# EAGLE board display72 (EAGLE 7.7.0), part 1 of 2
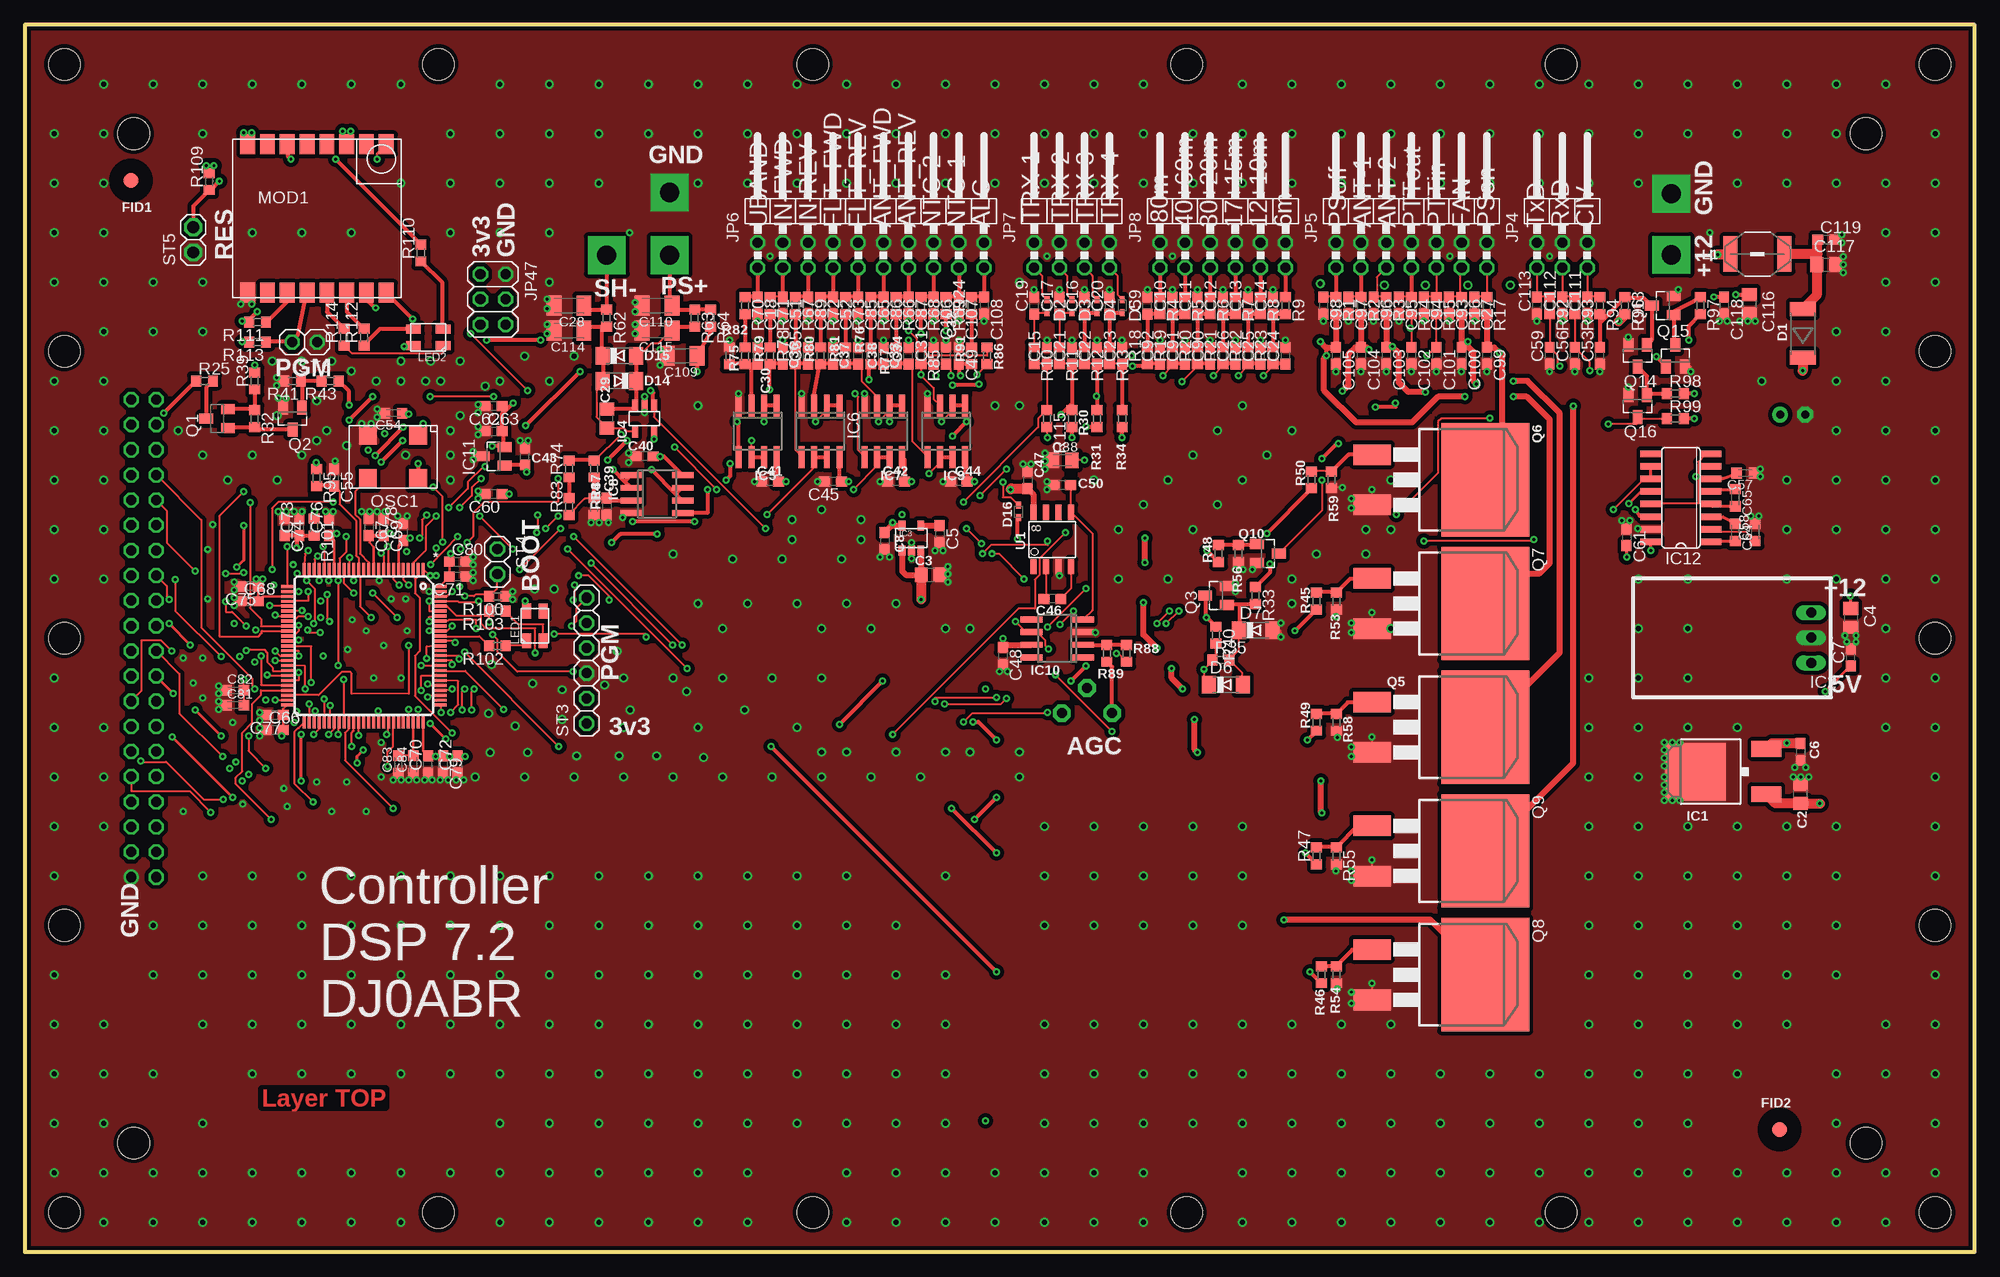
[diagram p5: board, top side]
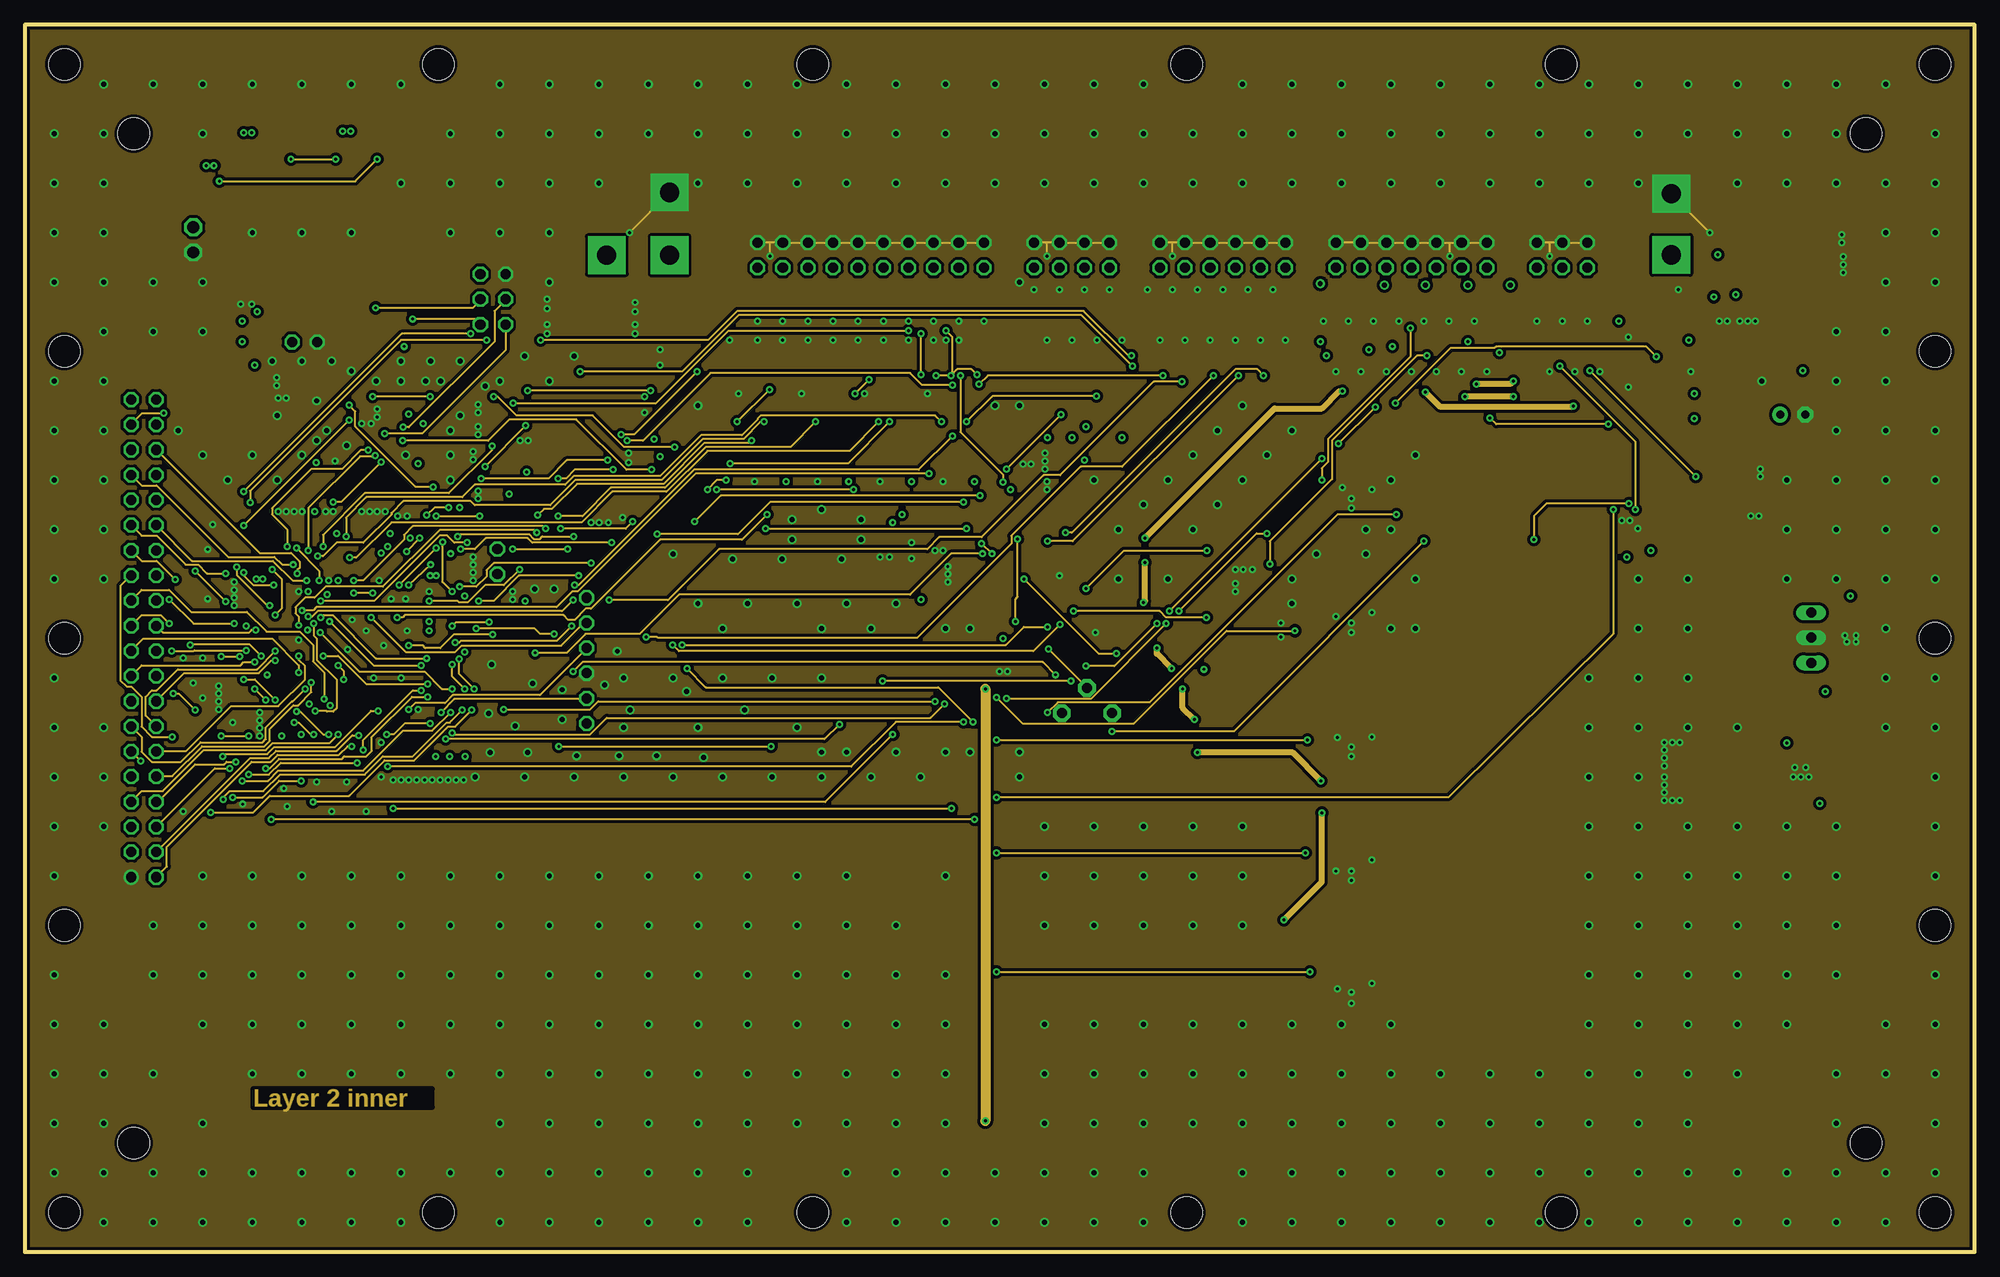
[diagram p6: board, inner layer Route2]
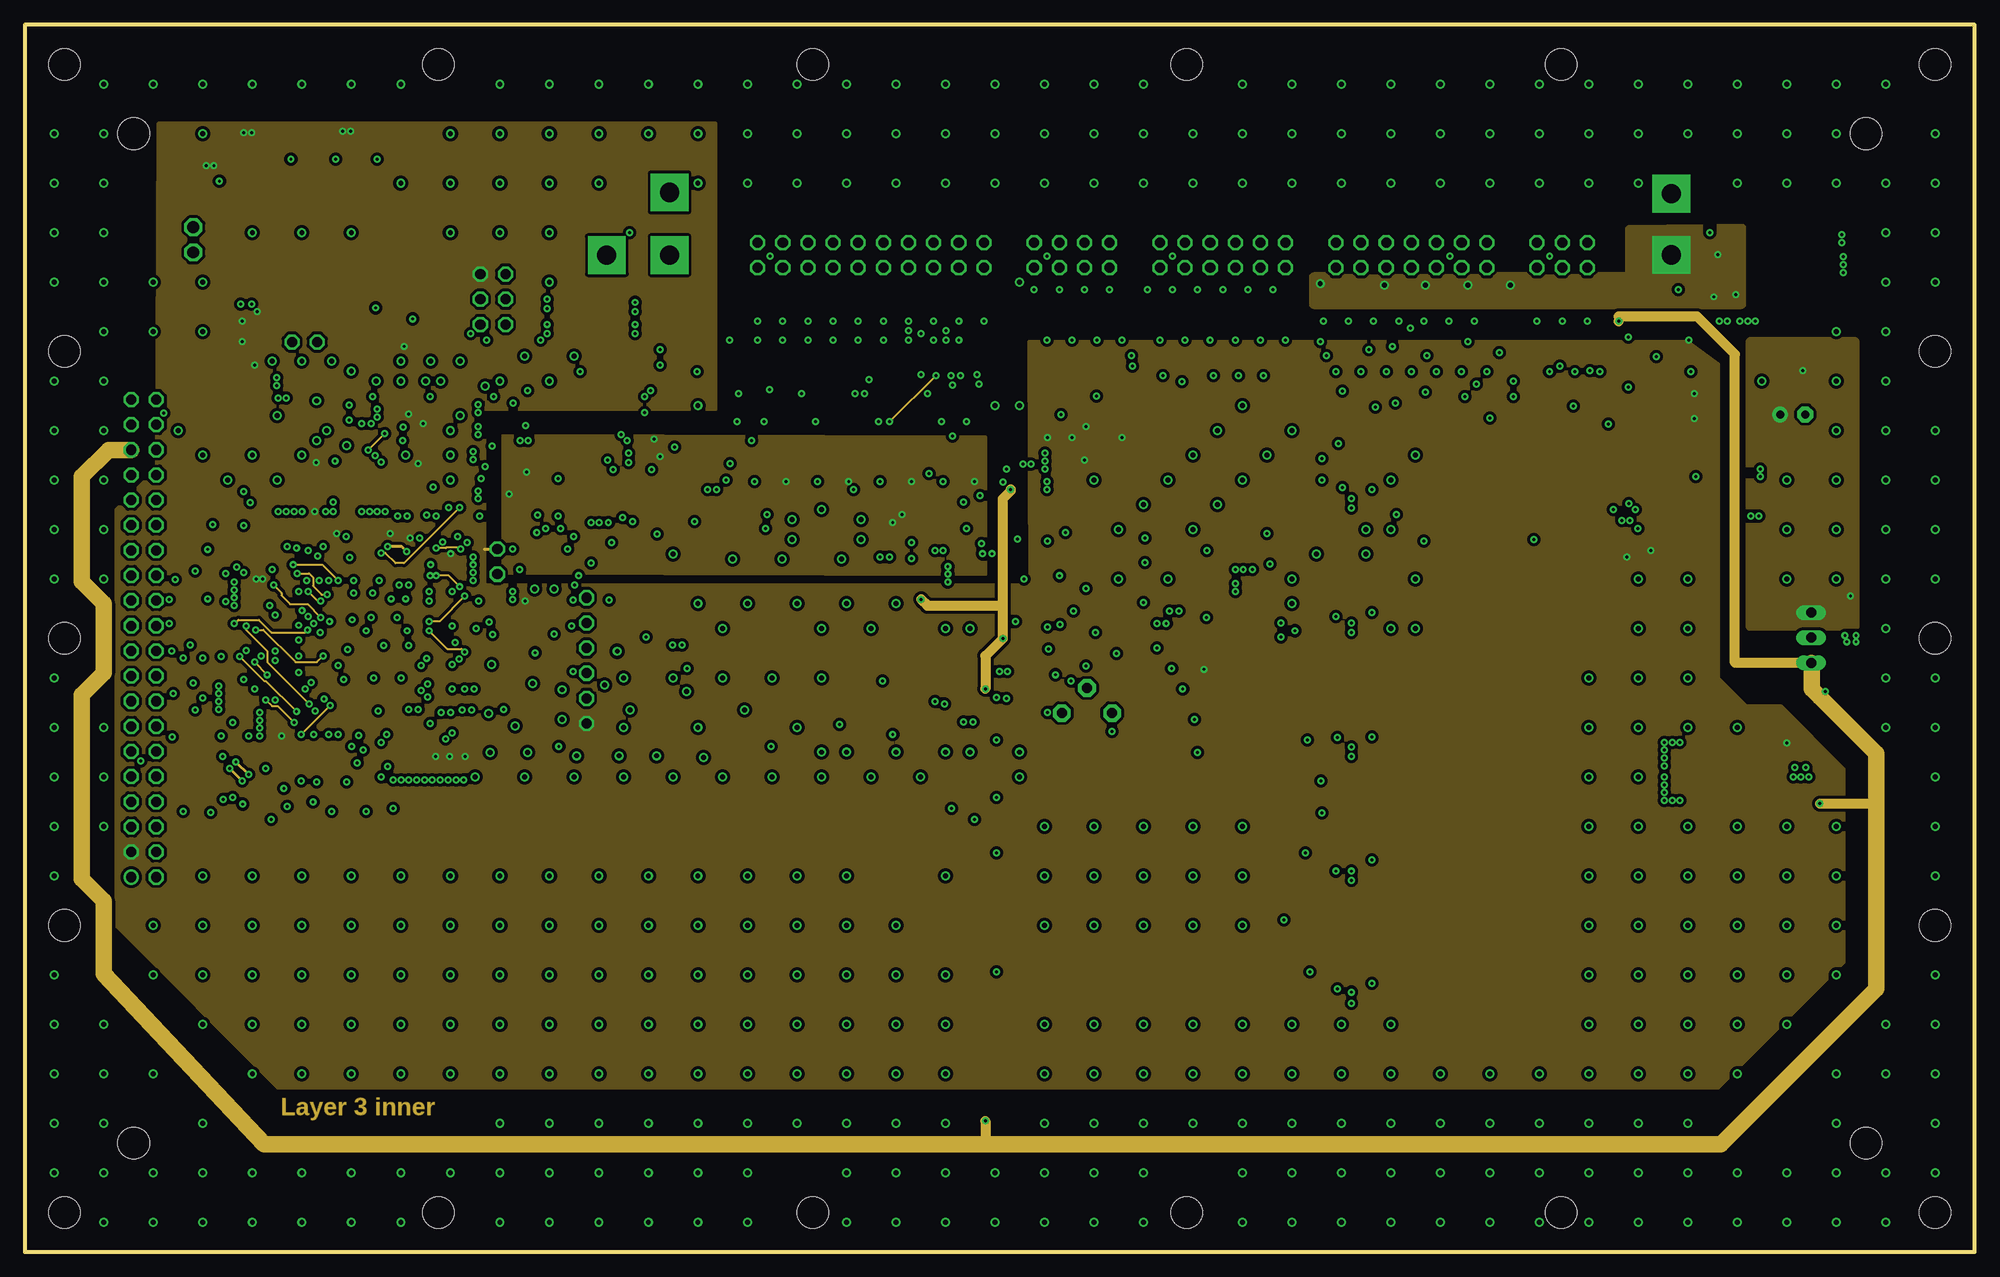
[diagram p7: board, inner layer Route3]
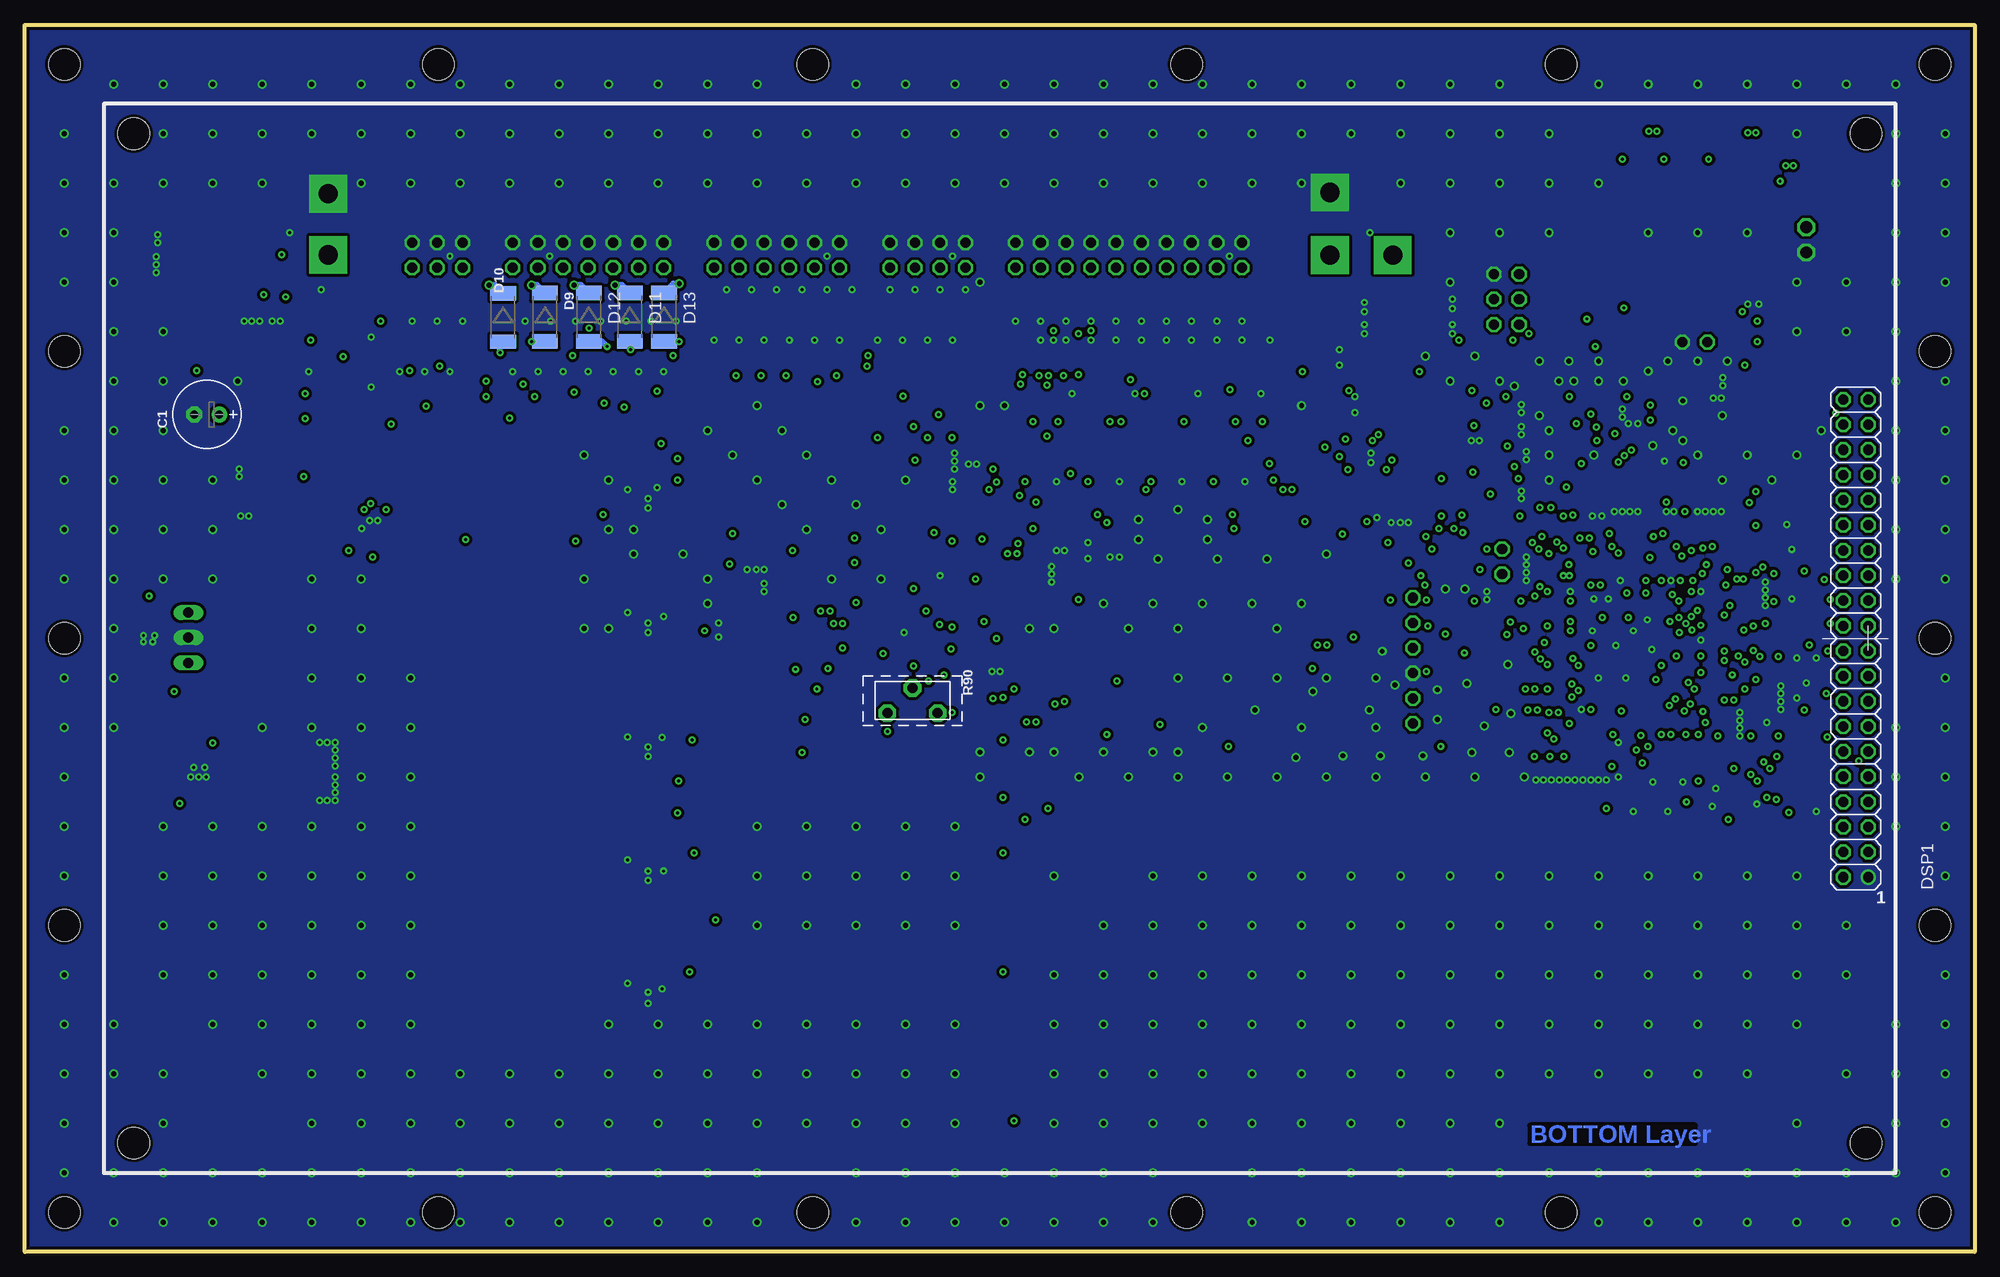
[diagram p8: board, bottom side, seen from below]

Size 197 x 124 mm. Coordinates in mm from the lower left corner, seen from the top.
Outline: 0,0 197,0 197,124 0,124 0,0
Copper layers (1+2*3+16): Top 0.035mm / dielectric 1.5mm / Route2 0.035mm / dielectric 0.15mm / Route3 0.035mm / dielectric 0.2mm / AGND$ 0.035mm
Design rules "default *": minimum track width 8mil, minimum drill 0.3mm, track to track 7mil, track to pad 7mil, pad to pad 7mil, via to via 7mil, smd to smd 0mil, copper to edge 10mil, drill to drill 8mil, minimum pad ring 10mil, minimum via ring 8mil, stop-mask expansion 0.02mm, vias tented up to drill 0.52mm, thermal gap 10mil
Net classes: 0 default: drill 0.3 mm; 1 Supply: width 0.203 mm, drill 0.3 mm, clearance 0.178 mm; 2 v12: drill 0.3 mm; 3 v533: drill 0.3 mm; 4 AGND: width 0.152 mm
Holes 3.2 mm at 4,120 193,120 193,4 4,4 4,91 4,62 4,33 193,91 193,62 193,33 41.8,120 79.6,120 117.4,120 155.2,120 41.8,4 79.6,4 117.4,4 155.2,4

## Footprints (pad centres in the part's own frame; a part is rotated, then mirrored left to right if it is on the bottom)
E2,5-7 = drill 0.813 pad 1.6: + -1.27,0 | drill 0.813 pad 1.6 octagon: - 1.27,0
C0805 = smd 1.3 x 1.5: 1 -0.95,0; 2 0.95,0
C0603 = smd 1.1 x 1: 1 -0.85,0; 2 0.85,0
C1206K = smd 1.5 x 2: 1 -1.5,0; 2 1.5,0
C0603K = smd 1.05 x 1.08: 1 -0.875,0; 2 0.875,0
C0805K = smd 1.3 x 1.6: 1 -1,0; 2 1,0
MELF = smd 1.45 x 2.6: 1 -2.445,0; 2 2.445,0
SOD523 = smd 0.7 x 0.5: A 0.7,0; C -0.6,0
MINIMELF = smd 1.4 x 1.8: A 1.7,0; C -1.7,0
2X20 = drill 1.016: 1 2.747,78.13 | drill 1.016 octagon: 2 5.287,78.13; 3 2.747,75.59; 4 5.287,75.59; 5 2.747,73.05; 6 5.287,73.05; 7 2.747,70.51; 8 5.287,70.51; 9 2.747,67.97; 10 5.287,67.97; 11 2.747,65.43; 12 5.287,65.43; 13 2.747,62.89; 14 5.287,62.89; 15 2.747,60.35; 16 5.287,60.35; 17 2.747,57.81; 18 5.287,57.81; 19 2.747,55.27; 20 5.287,55.27; 21 2.747,52.73; 22 5.287,52.73; 23 2.747,50.19; 24 5.287,50.19; 25 2.747,47.65; 26 5.287,47.65; 27 2.747,45.11; 28 5.287,45.11; 29 2.747,42.57; 30 5.287,42.57; 31 2.747,40.03; 32 5.287,40.03; 33 2.747,37.49; 34 5.287,37.49; 35 2.747,34.95; 36 5.287,34.95; 37 2.747,32.41; 38 5.287,32.41; 39 2.747,29.87; 40 5.287,29.87 | hole 3.2: 3,105; 178,105; 178,3; 3,3
FIDUCIAL = smd 1.5 x 1.5: P$1 0,0
DPACK = smd 1.6 x 3: 1 -2.28,-4.8; 3 2.28,-4.8 | smd 5.8 x 6.2: 4 0,2.38
78SR_SWITCHREG = drill 1.016 long: 1 2.54,0; 2 0,0; 3 -2.54,0
SOT23-5 = smd 0.686 x 0.991: 1 -0.953,0; 2 0,0; 3 0.953,0; 4 0.953,2.54; 5 -0.953,2.54
SOT23-5' = smd 0.6 x 1.2: 1 -0.95,-1.306; 2 0,-1.306; 3 0.95,-1.306; 4 0.95,1.306; 5 -0.95,1.306
SO08 = smd 0.6 x 2.2: 1 -1.905,-2.6; 2 -0.635,-2.6; 3 0.635,-2.6; 4 1.905,-2.6; 5 1.905,2.6; 6 0.635,2.6; 7 -0.635,2.6; 8 -1.905,2.6
SOT23 = smd 1 x 1.4: 1 -0.95,-1.1; 2 0.95,-1.1; 3 0,1.1
SO16 = smd 0.66 x 2.032: 1 -4.445,-3.073; 2 -3.175,-3.073; 3 -1.905,-3.073; 4 -0.635,-3.073; 5 0.635,-3.073; 6 1.905,-3.073; 7 3.175,-3.073; 8 4.445,-3.073; 9 4.445,3.073; 10 3.175,3.073; 11 1.905,3.073; 12 0.635,3.073; 13 -0.635,3.073; 14 -1.905,3.073; 15 -3.175,3.073; 16 -4.445,3.073
TQFP100 = smd 1.2 x 0.3: 1 -7.75,6; 2 -7.75,5.5; 3 -7.75,5; 4 -7.75,4.5; 5 -7.75,4; 6 -7.75,3.5; 7 -7.75,3; 8 -7.75,2.5; 9 -7.75,2; 10 -7.75,1.5; 11 -7.75,1; 12 -7.75,0.5; 13 -7.75,0; 14 -7.75,-0.5; 15 -7.75,-1; 16 -7.75,-1.5; 17 -7.75,-2; 18 -7.75,-2.5; 19 -7.75,-3; 20 -7.75,-3.5; 21 -7.75,-4; 22 -7.75,-4.5; 23 -7.75,-5; 24 -7.75,-5.5; 25 -7.75,-6; 51 7.75,-6; 52 7.75,-5.5; 53 7.75,-5; 54 7.75,-4.5; 55 7.75,-4; 56 7.75,-3.5; 57 7.75,-3; 58 7.75,-2.5; 59 7.75,-2; 60 7.75,-1.5; 61 7.75,-1; 62 7.75,-0.5; 63 7.75,0; 64 7.75,0.5; 65 7.75,1; 66 7.75,1.5; 67 7.75,2; 68 7.75,2.5; 69 7.75,3; 70 7.75,3.5; 71 7.75,4; 72 7.75,4.5; 73 7.75,5; 74 7.75,5.5; 75 7.75,6 | smd 0.3 x 1.2: 26 -6,-7.75; 27 -5.5,-7.75; 28 -5,-7.75; 29 -4.5,-7.75; 30 -4,-7.75; 31 -3.5,-7.75; 32 -3,-7.75; 33 -2.5,-7.75; 34 -2,-7.75; 35 -1.5,-7.75; 36 -1,-7.75; 37 -0.5,-7.75; 38 0,-7.75; 39 0.5,-7.75; 40 1,-7.75; 41 1.5,-7.75; 42 2,-7.75; 43 2.5,-7.75; 44 3,-7.75; 45 3.5,-7.75; 46 4,-7.75; 47 4.5,-7.75; 48 5,-7.75; 49 5.5,-7.75; 50 6,-7.75; 76 6,7.75; 77 5.5,7.75; 78 5,7.75; 79 4.5,7.75; 80 4,7.75; 81 3.5,7.75; 82 3,7.75; 83 2.5,7.75; 84 2,7.75; 85 1.5,7.75; 86 1,7.75; 87 0.5,7.75; 88 0,7.75; 89 -0.5,7.75; 90 -1,7.75; 91 -1.5,7.75; 92 -2,7.75; 93 -2.5,7.75; 94 -3,7.75; 95 -3.5,7.75; 96 -4,7.75; 97 -4.5,7.75; 98 -5,7.75; 99 -5.5,7.75; 100 -6,7.75
THICKPIN = drill 1.93 pad 3.81 square: 1 0,0
2X03/90 = drill 1.016 octagon: 1 -2.54,-6.35; 2 -2.54,-3.81; 3 0,-6.35; 4 0,-3.81; 5 2.54,-6.35; 6 2.54,-3.81
2X07/90 = drill 1.016 octagon: 1 -7.62,-6.35; 2 -7.62,-3.81; 3 -5.08,-6.35; 4 -5.08,-3.81; 5 -2.54,-6.35; 6 -2.54,-3.81; 7 0,-6.35; 8 0,-3.81; 9 2.54,-6.35; 10 2.54,-3.81; 11 5.08,-6.35; 12 5.08,-3.81; 13 7.62,-6.35; 14 7.62,-3.81
2X10/90 = drill 1.016 octagon: 1 -11.43,-6.35; 2 -11.43,-3.81; 3 -8.89,-6.35; 4 -8.89,-3.81; 5 -6.35,-6.35; 6 -6.35,-3.81; 7 -3.81,-6.35; 8 -3.81,-3.81; 9 -1.27,-6.35; 10 -1.27,-3.81; 11 1.27,-6.35; 12 1.27,-3.81; 13 3.81,-6.35; 14 3.81,-3.81; 15 6.35,-6.35; 16 6.35,-3.81; 17 8.89,-6.35; 18 8.89,-3.81; 19 11.43,-6.35; 20 11.43,-3.81
2X04/90 = drill 1.016 octagon: 1 -3.81,-6.35; 2 -3.81,-3.81; 3 -1.27,-6.35; 4 -1.27,-3.81; 5 1.27,-6.35; 6 1.27,-3.81; 7 3.81,-6.35; 8 3.81,-3.81
2X06/90 = drill 1.016 octagon: 1 -6.35,-6.35; 2 -6.35,-3.81; 3 -3.81,-6.35; 4 -3.81,-3.81; 5 -1.27,-6.35; 6 -1.27,-3.81; 7 1.27,-6.35; 8 1.27,-3.81; 9 3.81,-6.35; 10 3.81,-3.81; 11 6.35,-6.35; 12 6.35,-3.81
2X03 = drill 1.016 octagon: 1 -2.54,-1.27; 2 -2.54,1.27; 3 0,-1.27; 4 0,1.27; 5 2.54,-1.27; 6 2.54,1.27
S = smd 1.4 x 3.56: 1 -2.73,0; 2 2.73,0
PLCC4_WE_LED = smd 1.5 x 0.9: 1 1.51,0.88; 2 1.51,-0.82; 3 -1.49,0.88; 4 -1.49,-0.82
ESP8266-12 = smd 1.5 x 2: P$1 0,0; P$2 2,0; P$3 4,0; P$4 6,0; P$5 8,0; P$6 10,0; P$7 12,0; P$8 14,0; P$9 14,15; P$10 12,15; P$11 10,15; P$12 8,15; P$13 6,15; P$14 4,15; P$15 2,15; P$16 0,15
QOSC_AQO7015 = smd 1.8 x 2: 1 0,-0.318; 2 5.08,-0.318; 3 5.08,4.128; 4 0,4.128
D2PACK = smd 2.083 x 3.81: 1 -2.54,-8.89; 3 2.54,-8.89 | smd 11.43 x 8.89: 2 0,2.54
R0603 = smd 1 x 1.1: 1 -0.85,0; 2 0.85,0
MINIPOTI = drill 1.016 pad 1.778 octagon: 1 -2.54,-2.54; 2 2.54,-2.54; 3 0,0
PINHEAD6X1 = drill 1.016 octagon: 1 -6.35,0; 2 -3.81,0; 3 -1.27,0; 4 1.27,0; 5 3.81,0; 6 6.35,0
PINHEAD1X2 = drill 1.016 octagon: 1 -1.27,0; 2 1.27,0
PINHEAD1X2BIG = drill 1.2 octagon: 1 -2.54,0; 2 0,0
SO-8 = smd 0.61 x 1.524: 1 -1.905,-2.743; 2 -0.635,-2.743; 3 0.635,-2.743; 4 1.905,-2.743; 5 1.905,2.743; 6 0.635,2.743; 7 -0.635,2.743; 8 -1.905,2.743

## Placement (x,y rotation side)
C1  100u/16  [E2,5-7]  178.61,84.63 180 bottom
C2  10u  [C0805]  179.4,46.29 90 top
C3  10u  [C0805]  91.52,68.42 0 top
C4  10u  [C0805]  184.48,64.07 270 top
C5  10n  [C0603]  92.42,72.54 270 top
C6  10u  [C0603]  179.4,50.54 270 top
C7  10u  [C0603]  184.48,60.07 90 top
C8  10u  [C0603]  86.88,71.86 270 top
C9  100n  [C0603]  113.41,95.63 90 top
C10  100n  [C0603]  115.95,95.63 90 top
C11  100n  [C0603]  118.49,95.63 90 top
C12  100n  [C0603]  121.03,95.63 90 top
C13  100n  [C0603]  123.57,95.63 90 top
C14  100n  [C0603]  126.11,95.63 90 top
C15  100n  [C0603]  103.25,90.55 90 top
C16  100n  [C0603]  107.06,95.63 90 top
C17  100n  [C0603]  104.52,95.63 90 top
C18  100n  [C0603]  74.04,95.63 270 top
C19  100n  [C0603]  101.98,95.63 90 top
C20  100n  [C0603]  109.6,95.63 90 top
C21  100n  [C0603]  105.79,90.55 90 top
C22  100n  [C0603]  108.33,90.55 90 top
C23  100n  [C0603]  110.87,90.55 90 top
C24  100n  [C0603]  127.38,90.55 90 top
C25  100n  [C0603]  124.84,90.55 90 top
C26  100n  [C0603]  122.3,90.55 90 top
C27  100n  [C0603]  146.43,95.63 270 top
C28  100n/200V  [C1206K]  54.99,95.63 180 top
C29  10u  [C0805]  58.8,84.2 90 top
C30  100n  [C0603]  74.04,90.55 90 top
C31  1u  [C0603]  91.82,90.55 90 top
C32  1u  [C0603]  93.09,90.55 90 top
C33  10n  [C0603]  86.74,90.55 90 top
C34  10n  [C0603]  89.28,90.55 90 top
C35  10n  [C0603]  79.12,90.55 90 top
C36  10n  [C0603]  76.58,90.55 90 top
C37  10n  [C0603]  81.66,90.55 90 top
C38  10n  [C0603]  84.2,90.55 90 top
C39  1u  [C0603]  58.8,75.31 270 top
C40  1u  [C0603]  62.61,80.39 180 top
C41  1u  [C0603]  75.31,77.85 180 top
C42  1u  [C0603]  88.01,77.85 180 top
C43  1u  [C0603]  50.55,80.39 90 top
C44  1u  [C0603]  94.36,77.85 180 top
C45  1u  [C0603]  81.66,77.85 180 top
C46  10u  [C0603]  103.81,65.99 180 top
C47  1u  [C0603]  101.31,77.99 270 top
C48  1u  [C0603]  98.81,60.24 270 top
C49  10n  [C0603]  94.36,90.55 270 top
C50  10u  [C0603]  104.81,77.49 0 top
C51  10n  [C0603]  76.58,95.63 270 top
C52  10n  [C0603]  81.66,95.63 270 top
C53  1n  [C0603]  159.13,90.55 90 top
C54  1u  [C0603K]  37.25,84.75 180 top
C55  100n  [C0603]  31.25,78.25 270 top
C56  1n  [C0603]  156.59,90.55 90 top
C57  1u  [C0603K]  173.82,78.71 180 top
C58  1u  [C0603K]  174.82,72.71 90 top
C59  1n  [C0603]  154.05,90.55 90 top
C60  100n  [C0603]  47.37,76.58 180 top
C61  1u  [C0603]  161.82,72.21 270 top
C62  100n  [C0603]  47.37,85.47 180 top
C63  1u  [C0603]  47.37,82.93 0 top
C64  1u  [C0603K]  172.82,72.71 270 top
C65  1u  [C0603K]  172.82,76.21 270 top
C66  4u7  [C0603]  25.25,52.75 0 top
C67  100n  [C0603]  34.75,73.25 270 top
C68  100n  [C0603]  22.75,65.75 0 top
C69  100n  [C0603]  36.25,73.25 270 top
C70  100n  [C0603]  40.75,49.25 90 top
C71  100n  [C0603]  43.75,68.25 180 top
C72  100n  [C0603]  43.75,49.25 90 top
C73  100n  [C0603]  27.75,73.25 90 top
C74  1u  [C0603]  26.25,73.25 270 top
C75  100n  [C0603]  22.75,67.25 180 top
C76  100n  [C0603]  30.75,73.25 90 top
C77  100n  [C0603]  25.25,54.25 180 top
C78  100n  [C0603]  38.25,72.75 90 top
C79  100n  [C0603]  42.25,49.25 270 top
C80  100n  [C0603]  43.75,69.75 0 top
C81  1u  [C0603K]  21.25,55.25 0 top
C82  1u  [C0603K]  21.25,56.75 0 top
C83  1u  [C0603K]  37.75,49.25 90 top
C84  1u  [C0603K]  39.25,49.25 90 top
C85  10n  [C0603]  84.2,95.63 270 top
C86  10n  [C0603]  86.74,95.63 270 top
C87  10n  [C0603]  89.28,95.63 270 top
C88  10u  [C0805K]  104.81,79.99 0 top
C89  10n  [C0603]  79.12,95.63 270 top
C90  100n  [C0603]  119.76,90.55 90 top
C91  100n  [C0603]  117.22,90.55 90 top
C92  100n  [C0603]  114.68,90.55 90 top
C93  100n  [C0603]  143.89,95.63 270 top
C94  100n  [C0603]  141.35,95.63 270 top
C95  100n  [C0603]  138.81,95.63 270 top
C96  100n  [C0603]  136.27,95.63 270 top
C97  100n  [C0603]  133.73,95.63 270 top
C98  100n  [C0603]  131.19,95.63 270 top
C99  100n  [C0603]  147.7,90.55 270 top
C100  100n  [C0603]  145.16,90.55 270 top
C101  100n  [C0603]  142.62,90.55 270 top
C102  100n  [C0603]  140.08,90.55 270 top
C103  100n  [C0603]  137.54,90.55 270 top
C104  100n  [C0603]  135,90.55 270 top
C105  100n  [C0603]  132.46,90.55 270 top
C106  100n  [C0603]  91.82,95.63 270 top
C107  100n  [C0603]  94.36,95.63 270 top
C108  100n  [C0603]  96.9,95.63 270 top
C109  100n/200V  [C1206K]  66.42,90.55 180 top
C110  100n/200V  [C1206K]  63.88,95.63 180 top
C111  1n  [C0603]  157.86,95.63 90 top
C112  1n  [C0603]  155.32,95.63 90 top
C113  1n  [C0603]  152.78,95.63 90 top
C114  100n/200V  [C1206K]  54.99,93.09 180 top
C115  100n/200V  [C1206K]  63.88,93.09 180 top
C116  10u  [C0805]  174.21,95.79 270 top
C117  10u  [C0805]  181.99,99.76 0 top
C118  100n  [C0603]  171.67,95.63 270 top
C119  100n  [C0603]  181.99,102.3 0 top
D1  1N4001  [MELF]  179.62,92.81 90 top
D2  1N4448  [SOD523]  103.25,95.63 270 top
D3  1N4448  [SOD523]  105.79,95.63 270 top
D4  1N4448  [SOD523]  108.33,95.63 270 top
D5  1N4448  [SOD523]  110.87,95.63 270 top
D6  NTS245SFT1G  [MINIMELF]  121.35,57.32 0 top
D7  NTS245SFT1G  [MINIMELF]  124.35,62.82 0 top
D9  SS110B  [MELF]  144.44,94.45 270 bottom
D10  SS110B  [MELF]  148.68,94.43 270 bottom
D11  SS110B  [MELF]  135.88,94.45 270 bottom
D12  SS110B  [MELF]  140.02,94.45 270 bottom
D13  SS110B  [MELF]  132.41,94.45 270 bottom
D14  NTS245SFT1G  [MINIMELF]  60.07,88.01 180 top
D15  NTS245SFT1G  [MINIMELF]  60.07,90.55 0 top
D16  1N4448  [SOD523]  100.38,74.79 90 top
DSP1  DISPLAY7DISPL7_ARDUINO  [2X20]  8,116 180 bottom
FID1  FIDUCIAL  [FIDUCIAL]  10.73,108.26 0 top
FID2  FIDUCIAL  [FIDUCIAL]  177.29,12.37 0 top
IC1  LF33CDT-DPAK  [DPACK]  171.15,48.54 90 top
IC2  7805 (7962138)  [78SR_SWITCHREG]  180.48,62.07 90 top
IC3  LP2992 3v3  [SOT23-5]  89.58,70.87 0 top
IC4  INA193AQDBVRQ1  [SOT23-5']  62.61,84.2 180 top
IC5  TS27L2C  [SO08]  74.04,82.93 180 top
IC6  TS27L2C  [SO08]  80.39,82.93 180 top
IC7  TS27L2C  [SO08]  86.74,82.93 180 top
IC8  TS27L2C  [SO08]  63.88,76.58 270 top
IC9  TS27L2C  [SO08]  93.09,82.93 180 top
IC10  TL081D  [SO08]  104.31,61.99 90 top
IC11  ADR381  [SOT23]  47.37,80.39 90 top
IC12  MAX3232  [SO16]  167.32,76.21 90 top
IC13  STM32F427VGT6  [TQFP100]  34.25,61.25 270 top
JP1  [THICKPIN]  166.34,100.74 270 bottom
JP2  [THICKPIN]  166.34,106.92 270 bottom
JP4  [2X03/90]  155.32,105.79 0 top
JP5  [2X07/90]  140.08,105.79 0 top
JP6  [2X10/90]  85.47,105.79 0 top
JP7  TRX Detector  [2X04/90]  105.79,105.79 0 top
JP8  Band Relais  [2X06/90]  121.03,105.79 0 top
JP26  Pow.Supl. PLUS 0-100V  [THICKPIN]  65.15,100.71 270 top
JP27  GND  [THICKPIN]  65.15,107.06 0 top
JP38  Shunt-Load-side  [THICKPIN]  58.8,100.71 270 top
JP47  [2X03]  47.3,96.26 270 top
L1  WE74451147/47uH  [S]  175.05,100.84 180 top
LED1  RGBLED  [PLCC4_WE_LED]  51.57,63.25 90 top
LED2  RGBLED  [PLCC4_WE_LED]  40.77,92.44 180 top
MOD1  ESP-07S (ESP8266)  [ESP8266-12]  22.52,96.94 0 top
OSC1  OSZ8MHz  [QOSC_AQO7015]  39.75,82.25 180 top
Q1  IRLML6401  [SOT23]  19.43,84.2 90 top
Q2  N-CH_MOSFET  [SOT23]  27.05,84.2 180 top
Q3  N-CH_MOSFET  [SOT23]  120.35,66.32 90 top
Q5  IRF3704S  [D2PACK]  145,53.02 270 top
Q6  IRF3704S  [D2PACK]  145,78.02 270 top
Q7  IRF3704S  [D2PACK]  145,65.52 270 top
Q8  IRF3704S  [D2PACK]  145,28.02 270 top
Q9  IRF3704S  [D2PACK]  145,40.52 270 top
Q10  N-CH_MOSFET  [SOT23]  125.6,70.57 270 top
Q13  N-CH_MOSFET  [SOT23]  165.48,95.63 90 top
Q14  N-CH_MOSFET  [SOT23]  162.94,90.55 180 top
Q15  N-CH_MOSFET  [SOT23]  166.75,90.55 0 top
Q16  N-CH_MOSFET  [SOT23]  162.94,85.47 180 top
R1  1kOhm-Ferrit  [R0603]  132.46,95.63 270 top
R2  1kOhm-Ferrit  [R0603]  135,95.63 270 top
R3  1kOhm-Ferrit  [R0603]  137.54,95.63 270 top
R4  100  [R0603]  114.68,95.63 270 top
R5  100  [R0603]  117.22,95.63 270 top
R6  100  [R0603]  119.76,95.63 270 top
R7  100  [R0603]  122.3,95.63 270 top
R8  100  [R0603]  124.84,95.63 270 top
R9  100  [R0603]  127.38,95.63 270 top
R10  1kOhm-Ferrit  [R0603]  101.98,90.55 270 top
R11  1kOhm-Ferrit  [R0603]  104.52,90.55 270 top
R12  1kOhm-Ferrit  [R0603]  107.06,90.55 270 top
R13  1kOhm-Ferrit  [R0603]  109.6,90.55 270 top
R14  1kOhm-Ferrit  [R0603]  140.08,95.63 270 top
R15  1kOhm-Ferrit  [R0603]  142.62,95.63 270 top
R16  1kOhm-Ferrit  [R0603]  145.16,95.63 270 top
R17  1kOhm-Ferrit  [R0603]  147.7,95.63 270 top
R18  1kOhm-Ferrit  [R0603]  113.41,90.55 90 top
R19  1kOhm-Ferrit  [R0603]  115.95,90.55 90 top
R20  1kOhm-Ferrit  [R0603]  118.49,90.55 90 top
R21  1kOhm-Ferrit  [R0603]  121.03,90.55 90 top
R22  1kOhm-Ferrit  [R0603]  123.57,90.55 90 top
R23  1kOhm-Ferrit  [R0603]  126.11,90.55 90 top
R24  1kOhm-Ferrit  [R0603]  95.63,95.63 90 top
R25  220  [R0603]  18.16,88.01 0 top
R30  10k  [R0603]  105.79,84.2 270 top
R31  10k  [R0603]  108.33,84.2 270 top
R32  1k  [R0603]  23.24,84.2 270 top
R33  1k  [R0603]  124.35,66.32 270 top
R34  10k  [R0603]  110.87,84.2 270 top
R35  1M  [R0603]  120.85,59.82 0 top
R39  100  [R0603]  23.24,88.01 90 top
R40  100k  [R0603]  120.35,62.32 270 top
R41  100k  [R0603]  27.05,88.01 180 top
R43  1k  [R0603]  30.86,88.01 180 top
R45  1k  [R0603]  130.5,65.77 90 top
R46  1k  [R0603]  131,28.02 90 top
R47  1k  [R0603]  130.5,40.02 90 top
R48  1k  [R0603]  120.6,70.57 90 top
R49  1k  [R0603]  130.5,53.52 90 top
R50  1k  [R0603]  130,78.02 90 top
R53  100k  [R0603]  132.5,65.77 270 top
R54  100k  [R0603]  132.5,28.02 270 top
R55  100k  [R0603]  132.5,40.02 270 top
R56  100k  [R0603]  122.6,70.57 270 top
R58  100k  [R0603]  132.5,53.52 270 top
R59  100k  [R0603]  132,78.02 270 top
R62  1kOhm-Ferrit  [R0603]  58.8,94.36 270 top
R63  1kOhm-Ferrit  [R0603]  67.69,94.36 270 top
R64  1kOhm-Ferrit  [R0603]  69.28,94.36 270 top
R65  1kOhm-Ferrit  [R0603]  85.47,95.63 270 top
R66  1kOhm-Ferrit  [R0603]  88.01,95.63 270 top
R67  1kOhm-Ferrit  [R0603]  77.85,95.63 270 top
R68  1kOhm-Ferrit  [R0603]  90.55,95.63 270 top
R69  1kOhm-Ferrit  [R0603]  93.09,95.63 270 top
R70  1kOhm-Ferrit  [R0603]  72.77,95.63 270 top
R71  1kOhm-Ferrit  [R0603]  75.31,95.63 270 top
R72  1kOhm-Ferrit  [R0603]  80.39,95.63 270 top
R73  1kOhm-Ferrit  [R0603]  82.93,95.63 270 top
R74  NC  [R0603]  54.99,79.12 90 top
R75  22k  [R0603]  72.77,90.55 90 top
R76  1k  [R0603]  85.47,90.55 90 top
R77  1k  [R0603]  88.01,90.55 90 top
R78  1k  [R0603]  77.85,90.55 90 top
R79  1k  [R0603]  75.31,90.55 90 top
R80  1k  [R0603]  80.39,90.55 90 top
R81  1k  [R0603]  82.93,90.55 90 top
R82  10k  [R0603]  71.18,90.55 270 top
R83  390k/0,1%  [R0603]  54.99,75.31 90 top
R84  390k/0,1%  [R0603]  57.53,79.12 90 top
R85  8k2  [R0603]  90.55,90.55 270 top
R86  8k2  [R0603]  97.22,90.55 270 top
R87  10k/0,1%  [R0603]  57.53,75.31 90 top
R88  10k  [R0603]  111.31,60.49 90 top
R89  1k  [R0603]  109.31,60.49 90 top
R90  50k  [MINIPOTI]  107.31,56.99 0 bottom
R91  100  [R0603]  95.63,90.55 90 top
R92  1kOhm-Ferrit  [R0603]  154.05,95.63 270 top
R93  1kOhm-Ferrit  [R0603]  156.59,95.63 270 top
R94  1kOhm-Ferrit  [R0603]  159.13,95.63 270 top
R95  100k  [R0603]  29.5,78.25 270 top
R96  10k  [R0603]  161.67,95.63 270 top
R97  10k  [R0603]  169.29,95.63 270 top
R98  10k  [R0603]  166.75,86.74 0 top
R99  10k  [R0603]  166.75,84.2 0 top
R100  10k  [R0603]  47.75,66.25 180 top
R101  1kOhm-Ferrit  [R0603]  29.25,73.25 270 top
R102  2k2  [R0603]  47.75,61.25 180 top
R103  680  [R0603]  47.75,64.75 180 top
R109  100k  [R0603]  18.64,108.16 90 top
R110  1k  [R0603]  40.02,100.94 90 top
R111  100k  [R0603]  23.52,93.94 180 top
R112  1k  [R0603]  34.27,92.44 90 top
R113  100k  [R0603]  23.52,91.94 180 top
R114  1k  [R0603]  32.27,92.44 90 top
R115  10k  [R0603]  103.25,84.2 270 top
ST3  SWD  [PINHEAD6X1]  56.75,59.75 90 top
ST4  [PINHEAD1X2]  47.75,69.75 270 top
ST5  [PINHEAD1X2BIG]  17.03,103.54 90 top
ST6  PGM  [PINHEAD1X2]  28.27,91.94 180 top
U1  TC7662AEPASOIC  [SO-8]  103.81,71.99 0 top

## Tracks (layer width: path | path; a pad name or v marks a point on that pad's centre or on a via)
+5V  (via drill 0.3)
  Top 0.203: 184.45,59.2 C7.1 | v98.81,61.98 98.96,61.82 98.96,61.66 99.08,61.35
  Top 0.305: v181.91,56.66 184.45,59.2
  Top 0.61: IC3.3 90.57,70.83 C3.1 89.02,68.42 88.64,68.8 88.64,70.85 IC3.1 | C47.2 101.91,76.55 U1.8 | C48.1 99.08,61.35 IC10.7
  Top 1.016: IC1.1 176.87,45.34 C2.1 179.43,45.31 v181.35,45.31 | v161.03,94.04 161.67,94.68 R96.2 | v99.6,77.06 99.68,77.14 C47.2 | C3.1 90.55,68.41 v90.55,65.94
  Route2 1.016: v97.06,56.9 v97.06,13.24
  Route3 0.203: v181.91,56.66 181.35,56.1
  Route3 0.61: 99.6,76.9 v99.6,77.06
  Route3 1.016: IC2.3 172.78,59.53 172.78,90.71 168.97,94.52 161.03,94.52 v161.03,94.04 | 99.6,77.04 v99.6,77.06 | 98.81,65.31 v98.81,61.98 97.06,60.23 v97.06,56.9 | 98.81,65.31 98.81,76.1 99.6,76.9 | v181.35,45.31 187.07,45.31 | v90.55,65.94 91.19,65.31 98.81,65.31 | v97.06,13.24 97.06,10.86
  Route3 1.676: IC2.3 180.56,59.45 180.56,56.9 181.35,56.1 187.07,50.39 187.07,45.31 187.07,26.57 171.35,10.86 97.06,10.86 24.19,10.86 8,28.08 8,35.46 5.78,37.69 5.78,56.26 8,58.48 8,65.5 5.78,67.72 5.78,78.33 8.5,81.05 DSP1.35
+UB  (via drill 0.3)
  Top 0.203: 184.45,65.07 C4.1 | 179.61,90.31 D1.1
  Top 0.305: v184.45,66.26 184.45,65.07
  Top 1.016: 179.61,90.31 v179.61,89.04
  pour Route3 (isolate 0.305, no thermals): 174.37,91.98 184.85,91.98 184.85,63.24 174.37,63.24
/CS  (via drill 0.3)
  Top 0.203: v40.62,59.99 40.62,61.18 41.26,61.26 IC13.88 | v22.13,68.64 21.81,68.64 21.73,68.56 v20.3,68.56
  Route2 0.203: v40.62,59.99 35.46,59.99 31.1,64.36 30.15,64.36 v29.91,64.12 | v25.14,67.37 23.08,67.37 22.13,68.33 v22.13,68.64 | v20.3,68.56 18.4,68.56 17.52,69.44 16.26,69.44 13.32,72.37 11.81,72.37 10.78,73.41 DSP1.29
  Route3 0.203: v29.91,64.12 28.56,65.47 26.81,65.47 25.94,66.34 25.94,66.58 v25.14,67.37
/RD  (via drill 0.3)
  Top 0.203: v43.16,59.36 43.16,59.75 42.05,59.75 IC13.85 | v44.43,56.9 44.2,56.66 v44.2,54.75 | v20.07,45.7 18.08,45.7 14.27,49.51 11.73,49.51 v11.73,49.59
  Route2 0.203: v43.16,59.36 43.16,58.16 v44.43,56.9 | v44.2,54.75 42.92,53.48 42.61,53.48 39.19,50.07 36.18,50.07 34.35,48.24 25.78,48.24 24.11,46.58 20.7,46.58 20.07,45.94 v20.07,45.7 | v11.73,49.59 10.78,50.55 DSP1.11
/RES  (via drill 0.3)
  Top 0.203: v32.21,57.85 32.21,53.56 IC13.59 | v31.65,67.85 v31.65,59.28
  Route2 0.203: v32.21,57.85 32.21,58.72 v31.65,59.28 | v27.13,69.44 26.02,69.44 25.22,70.23 20.54,70.23 13.32,77.45 11.81,77.45 10.78,78.48 DSP1.33
  Route3 0.203: v31.65,67.85 30.07,69.44 v27.13,69.44
/RW  (via drill 0.3)
  Top 0.203: v43.88,59.91 43.88,60.23 42.05,60.23 IC13.86 | v45.39,56.9 45.15,56.66 v45.15,54.75 | v18.8,44.43 16.65,46.58 10.78,46.58 10.78,48.01 DSP1.9
  Route2 0.203: v43.88,59.91 43.88,58.4 v45.39,56.9 | v45.15,54.75 43.48,53.09 42.77,53.09 39.35,49.67 36.34,49.67 32.77,46.1 24.75,46.1 23.08,44.43 v18.8,44.43
AGND  (via drill 0.3, 0.5)
  Top 0.203: v19.59,55.62 19.59,55.31 20.3,55.31 C81.1 | v19.59,56.42 19.59,56.74 20.3,56.74 C82.1 | v35.62,84.36 35.62,84.68 36.34,84.68 C54.2 | v38,47.69 38,48.08 37.77,48.32 C83.1 | v39.59,47.69 39.59,48.01 39.27,48.32 C84.1 | v175.16,74.36 175.16,73.96 174.85,73.64 C58.2 | v175.32,78.33 175.32,78.64 174.77,78.64 C57.1 | v23.72,52.93 23.72,52.77 24.35,52.77 C66.1 | v23.72,54.51 23.72,54.28 24.35,54.28 C77.2 | v40.38,47.69 40.38,48.01 40.7,48.32 C70.1 | v21.18,66.1 21.18,65.78 21.89,65.78 C68.1 | v41.97,47.69 41.97,48.08 42.21,48.32 C79.2 | v21.18,66.9 21.18,67.21 21.89,67.21 C75.2 | v43.56,47.69 43.56,48.16 43.72,48.32 C72.1 | v26.41,74.83 26.41,74.28 26.26,74.12 C74.1 | v28,74.83 28,74.36 27.76,74.12 C73.2 | v30.38,74.83 30.38,74.44 30.7,74.12 C76.2 | v31.34,79.91 31.34,79.2 31.26,79.12 C55.1 | v34.83,74.83 34.83,74.12 C67.1 | v38.64,74.36 38.64,73.96 38.32,73.64 C78.2 | v49.27,65.94 49.27,66.18 48.64,66.18 R100.1 | v45.31,68.64 45.31,68.33 44.67,68.33 C71.1 | v36.42,74.83 36.42,74.28 36.26,74.12 C69.1 | R41.2 25.46,88.01 v25.46,88.33 | v45.31,69.44 45.31,69.67 44.67,69.67 C80.2 | C60.2 45.78,76.58 v45.78,76.9 | C63.1 45.78,82.93 v45.78,82.61 | v50.86,81.98 50.86,81.58 50.55,81.26 C43.2 | C62.2 45.78,85.47 v45.78,85.63 | v57.21,73.72 57.21,74.12 57.53,74.44 R87.1 | v58.96,73.72 58.96,74.28 58.8,74.44 C39.2 | C40.2 61.02,80.39 v61.02,80.71 | v73.72,77.85 C41.2 | v80.07,77.85 C45.2 | v98.49,58.64 98.49,59.04 98.81,59.36 C48.2 | v86.42,70.23 86.42,70.55 86.82,70.94 C8.2 | v71.18,92.14 R82.1 | v132.62,26.57 132.62,27.05 132.54,27.13 R54.2 | C5.2 92.77,71.34 v92.77,70.86 | v74.04,92.14 C30.2 | v86.42,77.85 C42.2
  Top 0.203: v76.58,92.14 C36.2 | v74.04,94.04 C18.2 | v79.12,92.14 C35.2 | v92.77,77.85 C44.2 | v76.58,94.04 C51.2 | v132.46,38.48 132.46,39.12 R55.2 | v81.66,92.14 C37.2 | v79.12,94.04 C89.2 | v84.2,92.14 C38.2 | v81.66,94.04 C52.2 | v101.66,79.6 101.66,79.2 101.34,78.88 C47.1 | v86.74,92.14 C33.2 | v84.2,94.04 C85.2 | v103.25,77.85 103.25,77.53 103.89,77.53 C50.1 | v89.28,92.14 C34.2 | v86.74,94.04 C86.2 | v91.82,92.14 C31.2 | v93.09,92.14 C32.2 | v89.28,94.04 C87.2 | v94.36,92.14 C49.1 | v132.62,51.97 132.62,52.53 132.54,52.61 R58.2 | v91.82,94.04 C106.2 | v94.36,94.04 C107.2 | v96.9,94.04 C108.2 | v103.25,92.14 C15.2 | v122.3,68.96 122.3,69.44 122.54,69.67 R56.2 | v105.79,92.14 C21.2 | v101.98,97.22 C19.2 | v108.33,92.14 C22.2 | v132.46,64.2 132.46,64.91 R53.2 | v104.52,97.22 C17.2 | v110.87,92.14 C23.2 | v107.06,97.22 C16.2 | v114.68,92.14 C92.2 | v109.6,97.22 C20.2 | v117.22,92.14 C91.2 | v113.41,97.22 C9.2 | v133.09,77.22 132.06,77.22 R59.2 | v119.76,92.14 C90.2 | v115.95,97.22 C10.2 | v122.3,92.14 C26.2 | v118.49,97.22 C11.2 | v124.84,92.14 C25.2 | v121.03,97.22 C12.2 | v127.38,92.14 C24.2 | v123.57,97.22 C13.2 | v126.11,97.22 C14.2 | v132.46,88.96 C105.2 | v135,88.96 C104.2 | v131.19,94.04 C98.2 | v137.54,88.96 C103.2 | v133.73,94.04 C97.2 | v179.93,48.96 179.93,49.2 179.45,49.67 C6.2 | v140.08,88.96 C102.2 | v136.27,94.04 C96.2 | v142.62,88.96 C101.2 | v138.81,94.04 C95.2 | v162.15,73.88 162.15,73.41 161.83,73.09 C61.1 | v145.16,88.96 C100.2 | v141.35,94.04 C94.2 | v147.7,88.96 C99.2 | v143.89,94.04 C93.2 | v146.43,94.04 C27.2 | v154.05,88.96 C59.1 | v156.59,88.96 C56.1 | v152.78,94.04 C113.1 | v159.13,88.96 C53.1 | v155.32,94.04 C112.1 | v157.86,94.04 C111.1 | v171.99,94.04 171.99,94.44 171.67,94.76 C118.2
  Top 0.203: C119.2 183.58,102.3 v183.58,101.98 | v184.05,61.66 184.05,61.34 184.45,60.94 C7.2 | v62.61,84.83 IC4.2 | v26.41,86.26 26.41,85.55 26.18,85.31 Q2.2 | IC11.3 45.31,80.39 v45.31,80.07 | v122.3,67.53 122.3,67.29 121.51,67.29 Q3.2 | v124.05,68.96 124.05,69.2 124.44,69.59 Q10.2 | v161.99,87.38 161.99,86.58 Q16.2 | v161.99,92.45 161.99,91.66 Q14.2 | v168.34,88.96 168.34,89.44 167.7,89.44 Q15.2 | v167.07,97.22 167.07,97.06 166.59,96.58 Q13.2 | v93.25,68.48 92.53,68.48 C3.2 | v179.45,48.01 179.45,47.29 C2.2 | v174.05,94.04 174.05,94.68 C116.2 | v183.74,99.76 C117.2 | v185.01,62.29 185.01,62.61 184.53,63.09 C4.2 | v104.52,68.33 104.52,69.2 U1.3 | v103.09,79.91 103.81,79.91 C88.1 | v126.9,62.13 126.9,62.77 126.11,62.77 D7.A | v34.99,83.72 34.99,82.93 34.67,82.61 OSC1.2 | v22.92,95.79 22.92,96.5 22.53,96.9 MOD1.P$1 | v64.2,89.6 64.2,89.84 C109.2 | C114.2 52.77,93.09 v52.77,92.77 | C28.2 52.77,95.63 v52.77,95.31 | C115.2 61.66,93.09 v61.66,92.77 | C110.2 61.66,95.63 v61.66,95.95 | v162.94,73.09 164.21,73.09 IC12.15 | IC8.4 60.39,74.67 v60.39,74.2 | v72.14,86.74 IC5.4 | v78.48,86.74 IC6.4 | v108.17,62.61 106.98,62.61 IC10.3 | v84.83,86.74 IC7.4 | v91.19,86.74 IC9.4 | v136.11,27.13 136.11,25.54 Q8.3 | v136.11,39.59 136.11,38 Q9.3 | v136.11,52.05 136.11,50.55 Q5.3 | v136.11,64.59 136.11,63.01 Q7.3 | v136.11,77.06 136.11,75.55 Q6.3 | v167.23,45.62 167.23,46.97 168.73,48.48 IC1.4
  Top 0.254: v35.78,67.85 35.75,67.88 IC13.10 | v40.86,66.74 40.87,66.75 IC13.99 | v39.75,54.83 IC13.74 | v27.68,61.82 27.62,61.75 IC13.37 | v27.68,66.74 v27.67,66.75 IC13.27 | v30.7,67.85 30.75,67.9 IC13.20
  Top 0.61: v89.6,71.66 89.58,71.64 IC3.2
  Route2 0.203: 75.31,101.98 JP6.4 JP6.6 JP6.8 JP6.10 JP6.12 JP6.14 JP6.16 JP6.18 JP6.20 | 75.31,101.98 JP6.2 | JP5.2 JP5.4 JP5.6 JP5.8 JP5.10 143.97,101.98 | 143.97,101.98 JP5.12 JP5.14 | 115.95,101.98 JP8.4 JP8.6 JP8.8 JP8.10 JP8.12 | 115.95,101.98 JP8.2 | 103.25,101.98 JP7.4 JP7.6 JP7.8 | 103.25,101.98 JP7.2 | 154.05,101.98 JP4.4 JP4.6 | 154.05,101.98 JP4.2 | v154.05,100.63 154.05,101.98 | v103.25,100.63 103.25,101.98 | v115.95,100.63 115.95,101.98 | v170.24,103.01 166.35,106.9 JP2.1 | v61.1,103.01 JP27.1 | v143.97,100.63 143.97,101.98 | v75.31,100.63 75.31,101.98
  AGND$ 0.203: v154.05,100.63 154.05,100.52 | v103.25,100.63 103.25,100.52 | v115.95,100.63 115.95,100.52 | v143.97,100.63 143.97,100.52 | v75.31,100.63 75.31,100.52
  other vias: 61.66,95 61.66,93.72 52.77,96.27 52.77,93.72 64.2,91.19 62.61,86.42 61.02,79.75 37.21,47.69 38.8,47.69 41.18,47.69 42.77,47.69 44.35,47.69 23.72,53.72 23.72,52.13 19.59,57.21 19.59,54.83 21.18,67.69 21.18,65.31 25.62,74.83 27.21,74.83 31.18,74.83 34.03,74.83 35.62,74.83 37.69,74.36 45.31,70.23 45.31,67.85 49.27,66.74 34.03,83.72 35.62,85.15 45.78,76.1 45.78,83.41 45.31,80.87 50.07,81.98 45.78,84.83 25.62,86.26 25.46,87.53 21.81,95.79 161.35,73.88 174.37,74.36 175.32,79.12 183.9,62.29 185.01,61.66 178.81,48.96 178.66,48.01 180.24,48.01 165.64,51.5 166.43,51.5 167.23,51.5 165.64,45.62 166.43,45.62 165.64,50.7 165.64,49.91 165.64,49.12 165.64,48.01 165.64,47.21 165.64,46.42 89.6,70.07 91.98,70.86 93.25,67.69 93.25,69.28 87.38,70.23 134.05,76.1 134.05,75.15 134.05,63.56 134.05,62.61 134.05,51.02 134.05,50.07 134.05,38.48 134.05,37.53 134.05,26.26 134.05,25.14 123.09,68.96 122.3,66.74 126.9,63.56 99.28,58.64 103.25,77.06 100.87,79.6 103.09,80.71 103.09,79.12 58.01,73.72 183.58,102.77 183.74,100.55 183.74,98.96 174.85,94.04 173.26,94.04 171.19,94.04 8,118 13,118 18,118 23,118 28,118 33,118 38,118 48,118 53,118 58,118 63,118 68,118 73,118 78,118 83,118 88,118 8,113 3,113 3,108 3,103 3,98 8,108 8,103 8,98 8,93 8,88 3,88 3,83 8,83 18,113 43,113 48,113 53,113 58,113 63,113 68,113 73,113 78,113 83,113 88,113 88,108 83,108 78,108 73,108 68,108 58,108 53,108 48,108 43,108 38,108 23,103 28,103 33,103 43,103 48,103 53,103 13,98 13,93 18,98 18,93 53,98 53,88 38,88 3,78 3,73 3,68 3,58 3,53 3,48 3,43 8,78 8,73 8,68 8,53 8,48 8,43 15.5,83 18,80.5 20.5,78 23,80.5 30.5,83 28,80.5 25.5,78 43,83 40.5,88 48,88 50.5,90.5 55.5,90.5 68,85.5 93,118 98,118 103,118 108,118 113,118 123,118 128,118 133,118 138,118 143,118 148,118 153,118 158,118 163,118 168,118 173,118 178,118 93,113 98,113 103,113 108,113 113,113 118,113 123,113 128,113 133,113 138,113 143,113 148,113 153,113 158,113 163,113 168,113 173,113 178,113 93,108 98,108 103,108 108,108 113,108 118,108 123,108 128,108 133,108 138,108 143,108 148,108 153,108 158,108 163,108 173,108 178,108 100.5,98 100.5,85.5 98,85.5 108,78 115.5,78 118,80.5 120.5,83 123,85.5 128,83 125.5,80.5 123,78 120.5,75.5 118,73 110.5,73 113,75.5 110.5,68 115.5,68 128,65.5 128,68 130.5,70.5 135.5,70.5 135.5,73 138,73 138,78 140.5,80.5 140.5,68 140.5,63 138,63 93,63 95.5,63 183,118 188,118 183,113 183,108 188,108 193,108 193,113 188,103 193,103 193,98 188,98 188,93 183,93 183,88 188,88 183,83 188,83 193,83 193,78 188,78 183,78 183,73 188,73 193,73 193,68 188,68 183,68 178,68 178,73 178,78 175.5,88 168,68 163,68 163,63 168,63 65.5,70.5 68,65.5 73,65.5 78,65.5 80.5,63 83,65.5 85.5,63 88,65.5 70.5,63 70.5,58 75.5,58 80.5,58 60.5,58 65.5,58 71.5,70 76.5,70 82.5,70 77.5,72 84.5,72 77.5,74 84.5,74 80.5,75 51.5,67 53.5,67 60.5,53 68,53 78,53 80.5,50.5 83,50.5 88,50.5 93,50.5 95.5,50.5 100.5,50.5 100.5,48 90.5,48 45.5,48 50.5,48 55.5,48 60.5,48 65.5,48 70.5,48 75.5,48 85.5,48 80.5,48 35.5,88 43,80.5 43,78 25,90 28,90 31,90 33,89 38,90 41,90 44,90 42,88 46.5,87.5 44,84.5 38.5,80.5 32.5,81.5 29.5,82 29.5,86 25.5,84.5 37,66 38.5,66 18,60 16,60 17,57.5 18,56 21,53.5 18.5,66 19,73.5 18.5,71 36,51.5 36,48 32.5,47.5 29.5,47.5 26.18,46.84 16,44.5 22,45.25 26.5,45 31,44.5 34.5,44.5 47.01,50.46 50.82,50.46 55.74,50.14 60.02,50.14 63.83,50.14 68.6,49.98 61.13,54.75 72.72,54.75 66.85,56.65 58.59,57.29 47.16,59.35 51.29,57.45 54.31,56.81 54.31,53.79 46.85,54.43 49.55,53.16 59.87,60.7 33.08,63.88 34.51,62.77 38.64,62.77 32.61,60.86 3,38 3,28 3,23 3,18 3,13 3,8 8,8 8,3 13,3 18,3 23,3 33,3 28,3 38,3 48,3 53,3 58,3 63,3 68,3 73,3 73,8 68,8 63,8 58,8 53,8 48,8 43,8 38,8 33,8 28,8 23,8 18,8 13,8 8,13 8,18 8,23 13,18 18,13 13,33 13,28 18,33 18,38 23,38 28,38 33,38 38,38 43,38 48,38 53,38 58,38 63,38 68,38 73,38 78,38 78,33 73,33 68,33 63,33 58,33 53,33 48,33 43,33 38,33 33,33 28,33 23,33 18,28 23,28 28,28 33,28 38,28 43,28 48,28 53,28 58,28 63,28 68,28 73,28 78,28 78,23 78,18 73,18 73,23 68,23 63,23 58,23 53,23 48,23 43,23 38,23 33,23 28,23 23,23 18,23 23,18 28,18 33,18 38,18 43,18 48,18 53,18 58,18 63,18 68,18 78,13 73,13 68,13 63,13 58,13 53,13 48,13 83,38 83,33 83,28 83,23 83,18 83,13 83,8 83,3 88,3 88,8 88,13 88,18 88,23 88,28 88,33 93,38 93,28 93,23 93,18 93,13 93,8 93,3 98,3 98,8 103,3 103,8 103,13 103,18 103,23 103,33 103,38 103,43 108,43 108,38 108,33 108,23 108,18 108,13 108,8 108,3 113,3 113,8 113,13 113,18 113,23 113,33 113,38 113,43 118,43 123,43 118,38 123,38 123,33 118,33 118,23 123,23 128,23 133,23 138,23 138,18 133,18 128,18 123,18 118,18 118,13 123,13 128,13 133,13 138,13 138,8 133,8 128,8 123,8 123,3 128,3 133,3 138,3 143,3 148,3 148,8 143,8 143,13 148,13 143,18 148,18 153,3 153,8 153,13 153,18 158,3 163,3 168,3 173,3 178,3 158,8 163,8 168,8 173,8 178,8 158,13 163,13 168,13 158,18 163,18 168,18 173,18 183,3 188,3 183,8 188,8 193,8 193,13 193,18 193,23 193,28 193,38 193,43 193,48 193,53 193,58 188,63 188,58 188,53 188,23 188,18 183,18 183,13 178,23 183,28 183,33 183,38 183,43 158,23 158,28 158,33 158,38 158,43 158,48 158,53 158,58 163,58 168,58 163,53 163,48 163,43 163,38 163,33 163,28 163,23 168,23 168,28 168,33 168,38 173,38 173,33 173,28 173,23 178,28 178,33 178,38 178,43 173,43 168,43 168,53 173,53 36.26,61.26 35.23,58.01 38,58.01
  pour AGND$ (isolate 0.305, no thermals): 0,124 197,124 197,0 0,0
  pour Top (isolate 0.406, no thermals): -0.02,124.28 196.99,124.28 196.99,-0.33 -0.02,-0.33
  pour Route2 (isolate 0.305, no thermals): 0,124 0,0 197,0 197,124
FSMC0  (via drill 0.3)
  Top 0.203: v33,51.1 33,52.45 33.24,52.69 33.24,53.48 IC13.61
  Route2 0.203: v33,51.1 32.61,51.1 31.73,50.23 25.54,50.23 24.83,49.51 22.92,49.51 14.35,40.94 14.35,38.96 13.32,37.92 DSP1.2
FSMC1  (via drill 0.3)
  Top 0.203: v33.72,52.21 33.72,53.48 IC13.62
  Route2 0.203: v33.72,52.21 33.08,52.21 31.5,50.62 25.38,50.62 24.67,49.91 22.76,49.91 13.32,40.46 DSP1.4
FSMC2  (via drill 0.3)
  Top 0.203: v43,54.51 43.8,55.31 43.8,57.69 42.45,57.77 IC13.81
  Route2 0.203: v43,54.51 41.18,52.69 38.24,52.69 34.19,48.64 25.62,48.64 24.59,47.61 v21.97,47.61 | v20.7,48.88 19.19,48.88 13.32,43 DSP1.6
  Route3 0.305: v20.7,48.88 v21.97,47.61
FSMC3  (via drill 0.3)
  Top 0.203: v40.07,56.74 40.07,58.24 41.97,58.24 IC13.82
  Top 0.305: v34.19,50.7 33.56,50.07 v33.56,49.43
  Route2 0.203: v40.07,56.74 39.19,56.74 34.19,51.74 v34.19,50.7 | v33.56,49.43 25.86,49.43 24.67,48.24 v22.61,48.24 | v21.34,49.51 20.38,49.51 20.14,49.27 17.21,49.27 13.48,45.54 13.32,45.54 DSP1.8
  Route3 0.305: v21.34,49.51 v22.61,48.24
FSMC4  (via drill 0.3)
  Top 0.203: v28.95,57.53 28.95,61.18 26.57,61.18 IC13.38
  Route2 0.203: v28.95,57.53 28.95,56.58 27.61,55.23 27.13,55.23 24.75,52.85 24.75,51.66 24.19,51.1 17.92,51.1 14.91,48.08 13.32,48.08 DSP1.10
FSMC5  (via drill 0.3)
  Top 0.203: v27.68,60.23 27.68,60.7 26.57,60.7 IC13.39
  Route2 0.203: v27.68,60.23 27.68,59.83 28.32,59.2 28.32,57.85 25.62,55.15 20.86,55.15 16.33,50.62 13.32,50.62 DSP1.12
FSMC6  (via drill 0.3)
  Top 0.203: v25.3,60.7 25.78,60.23 26.49,60.23 IC13.40
  Route2 0.203: v25.3,60.7 23.48,58.88 15.46,58.88 13.32,56.74 12.84,56.74 12.21,56.1 12.21,54.2 13.24,53.16 DSP1.14
FSMC7  (via drill 0.3)
  Top 0.203: v25.3,59.75 IC13.41
  Route2 0.203: v25.3,59.75 24.91,59.75 23.64,58.48 16.1,58.48 13.32,55.7 DSP1.16
FSMC8  (via drill 0.3)
  Top 0.203: v28.32,56.9 28.32,59.2 27.05,59.28 IC13.42
  Route2 0.203: v28.32,56.9 27.05,55.62 26.97,55.62 24.35,53.01 24.35,51.81 24.03,51.5 17.76,51.5 15.78,49.51 12.84,49.51 11.81,50.55 11.81,52.05 10.78,53.09 DSP1.13
FSMC9  (via drill 0.3)
  Top 0.203: v22.37,60.78 22.37,60.86 24.19,60.86 24.51,60.55 24.51,59.59 25.07,59.04 25.07,58.72 26.49,58.72 IC13.43 | v14.83,60.7 13.71,61.82 11.81,61.82 11.81,56.74 10.78,55.7 DSP1.15
  Route2 0.203: v22.37,60.78 17.13,60.78 17.05,60.7 v14.83,60.7
FSMC10  (via drill 0.3)
  Top 0.203: v24.51,58.32 24.51,58.24 IC13.44
  Route2 0.203: v23.24,59.59 22.13,59.59 21.81,59.28 11.81,59.28 10.78,58.24 DSP1.17
  Route3 0.203: v23.24,59.59 v24.51,58.32
FSMC11  (via drill 0.3)
  Top 0.203: v27.68,58.56 27.68,57.77 26.57,57.77 IC13.45
  Route2 0.203: v27.68,58.56 27.68,59.28 24.99,61.98 11.97,61.98 10.78,60.78 DSP1.19
FSMC12  (via drill 0.3)
  Top 0.203: v23.88,60.23 23.88,57.29 26.49,57.29 IC13.46
  Top 0.305: v14.59,63.48 v16.73,61.34
  Route2 0.203: v23.88,60.23 22.68,61.42 16.81,61.42 v16.73,61.34 | v14.59,63.48 13.71,64.36 11.81,64.36 10.78,63.32 DSP1.21
FSMC13  (via drill 0.3)
  Top 0.203: v30.23,55.86 30.23,53.56 IC13.55
  Route2 0.203: v30.23,55.86 30.23,58.56 29.11,59.67 29.11,61.34 27.76,62.69 24.43,62.69 22.45,64.67 16.81,64.67 14.59,66.9 11.81,66.9 10.78,65.86 DSP1.23
FSMC14  (via drill 0.3)
  Top 0.203: v30.86,55.23 30.78,55.15 30.78,53.56 IC13.56
  Top 0.305: v27.92,47.61 v27.92,52.29 | v14.91,52.05 v21.02,45.94
  Route2 0.203: v27.92,47.61 25.7,47.61 24.03,45.94 v21.02,45.94 | v14.91,52.05 12.84,52.05 11.81,53.09 11.81,56.1 10.78,57.13 10.3,57.13 9.67,57.77 9.67,67.29 10.7,68.33 DSP1.25
  Route3 0.203: v27.92,52.29 v30.86,55.23
FSMC15  (via drill 0.3)
  Top 0.203: v30.7,52.29 31.26,52.85 31.26,53.48 IC13.57 | v19.83,60.15 15.22,64.75 v15.22,67.93
  Route2 0.203: v30.7,52.29 30.15,52.29 27.84,54.59 v27.45,54.59 | v19.83,60.15 v21.73,60.15 | v15.22,67.93 13.32,69.83 11.81,69.83 10.78,70.86 DSP1.27
  Route3 0.203: v27.45,54.59 24.35,57.69 24.19,57.69 v21.73,60.15
GPIOB4
  Top 0.203: R102.2 46.89,61.26 45.94,62.21 42.05,62.21 IC13.90
GPIOB5  (via drill 0.3)
  Top 0.203: v46.89,63.64 46.89,64.67 R103.2 | v43.16,63.24 42.69,62.77 42.05,62.77 IC13.91
  Route2 0.203: v46.89,63.64 43.56,63.64 v43.16,63.24
GPIOB6  (via drill 0.3)
  Top 0.203: v44.43,60.63 v53.96,51.1 | v40.86,62.77 41.34,63.24 41.97,63.24 IC13.92 | 130.95,27.21 R46.1
  Top 0.406: v129.84,28.32 130.95,27.21 | v75.39,51.1 v98.17,28.32
  Route2 0.203: v98.17,28.32 v129.84,28.32 | v53.96,51.1 v75.39,51.1
  Route3 0.203: v44.43,60.63 44.12,60.94 42.69,60.94 v40.86,62.77
GPIOB7  (via drill 0.3)
  Top 0.203: 121.03,89.76 R21.1 120.95,89.68 120.95,89.44 v120.08,88.57 | 122.3,89.76 C26.1 | v45.62,63.01 45.62,63.88 42.85,63.88 42.77,63.8 42.53,63.72 IC13.93 | v53.48,62.45 62.77,62.45 v62.77,62.13
  Top 0.406: 122.3,89.76 121.03,89.76
  Route2 0.203: v45.62,63.01 51.5,63.01 52.05,62.45 v53.48,62.45 | v62.77,62.13 63.88,62.13 63.96,62.05 90.15,62.05 99.68,71.58 99.68,72.37 106.66,79.36 110.87,79.36 v120.08,88.57
GPIOB8  (via drill 0.3)
  Top 0.203: R11.2 104.52,89.76 105.79,89.76 C21.1 | R30.1 105.79,85.63 105.71,85.63 | v40.86,65.78 40.86,64.75 41.97,64.75 IC13.95 | v54.12,73.09 v49.99,68.96 | v99.2,79.12 v96.5,76.42
  Top 0.406: C21.1 105.79,85.63 | v67.69,73.8 v61.42,73.8 | 105.71,85.63 v104.68,84.6
  Route2 0.203: v40.86,65.78 43.72,65.78 43.88,65.63 44.75,65.63 46.5,67.37 48.4,67.37 v49.99,68.96 | v54.12,73.09 60.7,73.09 v61.42,73.8 | v67.69,73.8 70.31,76.42 v96.5,76.42 | v104.68,84.6 v99.2,79.12
GPIOB9  (via drill 0.3)
  Top 0.203: 123.57,89.76 R22.1 123.49,89.68 123.49,89.44 v122.62,88.57 | 124.84,89.76 C25.1 | v51.58,60.55 51.58,63.01 46.58,63.01 46.1,63.48 46.1,64.28 43.64,64.28 42.69,65.23 42.05,65.23 IC13.96 | v96.74,70.55 97.61,71.42 103.33,71.42 v103.33,71.82
  Top 0.406: 124.84,89.76 123.57,89.76
  Route2 0.203: v51.58,60.55 54.75,60.55 56.66,62.45 62.13,62.45 66.1,66.42 89.44,66.42 93.57,70.55 v96.74,70.55 | v103.33,71.82 105.87,71.82 v122.62,88.57
GPIOB12  (via drill 0.3)
  Top 0.203: 126.11,89.76 R23.1 126.03,89.68 126.03,89.44 v125.16,88.57 | 127.38,89.76 C24.1 | v29.11,45.47 27.29,47.29 27.29,52.61 27.61,52.93 27.68,52.93 28.24,53.48 IC13.51 | v87.69,52.29 100.39,64.99 102.06,64.99 102.06,67.93 102.54,68.4 102.54,70.07 v105.16,72.69
  Top 0.406: 127.38,89.76 126.11,89.76
  Route2 0.203: v29.11,45.47 80.87,45.47 v87.69,52.29 | v105.16,72.69 105.79,72.69 122.3,89.2 124.52,89.2 v125.16,88.57
GPIOB13  (via drill 0.3)
  Top 0.203: v28.72,55.39 28.72,53.56 IC13.52 | v22.37,63.24 20.94,64.67 20.3,64.67 v20.3,65.71 | v17.21,68.8 14.35,71.66 14.35,74.91 13.32,75.94 DSP1.32
  Route2 0.203: v17.21,68.8 v20.3,65.71
  Route3 0.203: v28.72,55.39 24.51,59.59 24.51,60.7 22.37,62.85 v22.37,63.24
GPIOB14  (via drill 0.3)
  Top 0.203: v29.35,54.67 29.27,54.59 29.27,53.56 IC13.53 | v29.19,63.48 29.27,63.56 29.27,67.06 v28.48,67.85
  Route2 0.203: v29.35,54.67 30.46,54.67 30.54,54.59 31.18,54.59 31.5,54.91 31.5,57.85 29.51,59.83 29.51,61.98 29.19,62.29 v29.19,63.48 | v28.48,67.85 27.05,67.85 25.07,69.83 16.89,69.83 13.32,73.41 DSP1.30
GPIOB15  (via drill 0.3)
  Top 0.203: v29.19,52.29 29.75,52.85 29.75,53.48 IC13.54 | v23.24,56.9 23,57.13 23,57.93 17.84,63.09 17.84,73.96 13.32,78.48 DSP1.34
  Route2 0.203: v29.19,52.29 28.88,52.29 27.68,53.48 v27.21,53.48 | v23.24,56.9 v24.35,55.78
  Route3 0.203: v27.21,53.48 25.54,55.15 24.99,55.15 v24.35,55.78
GPIOC4  (via drill 0.3)
  Top 0.203: R12.2 107.06,89.76 108.25,89.76 C22.1 | v28.64,64.2 27.61,64.2 27.21,63.8 26.57,63.8 IC13.33 | v55.39,65.86 55.55,66.02 v55.55,67.37 | v108.25,86.5 108.33,86.5
  Top 0.406: C22.1 108.33,86.5 R31.1 | v95.15,83.88 v93.72,82.45
  Route2 0.203: v28.64,64.2 29.03,64.2 29.59,64.75 54.28,64.75 v55.39,65.86 | v55.55,67.37 55.94,67.37 67.61,79.04 90.31,79.04 v93.72,82.45 | v95.15,83.88 97.77,86.5 v108.25,86.5
GPIOC5  (via drill 0.3)
  Top 0.203: R13.2 109.6,89.76 110.79,89.76 C23.1 110.95,89.68 v111.82,90.55 | v22.76,75.71 22.76,65.07 23.88,63.96 23.88,63.24 IC13.34
  Top 0.406: C23.1 R34.1 | v52.13,92.14 v46.66,92.14
  Route2 0.203: v22.76,75.71 22.76,76.9 38,92.14 v46.66,92.14 | v52.13,92.14 69.04,92.14 71.98,95.07 106.98,95.07 111.5,90.55 v111.82,90.55
GPIOC9  (via drill 0.3)
  Top 0.203: v35.7,54.67 35.7,53.56 IC13.66 | v19.99,50.07 15.62,54.43 15.62,58.4 13.32,60.7 DSP1.20
  Route2 0.203: v35.7,54.67 34.99,54.67 31.34,51.02 25.22,51.02 24.51,50.31 20.22,50.31 v19.99,50.07
GPIOC10  (via drill 0.3)
  Top 0.203: v40.7,56.1 40.7,56.18 41.34,56.26 IC13.78 | v24.35,48.88 22.61,50.62 v22.61,52.13 | 13.32,58.16 13.32,58.09
  Top 0.305: v17.21,54.75 v19.83,52.13 | 13.32,58.09 v14.98,56.42 | 13.32,58.16 DSP1.18
  Route2 0.203: v40.7,56.1 39.12,56.1 35.07,52.05 35.07,50.62 34.51,50.07 32.29,50.07 32.05,49.83 25.7,49.83 24.75,48.88 v24.35,48.88 | v19.83,52.13 v22.61,52.13 | v17.21,54.75 15.54,56.42 v14.98,56.42
GPIOC11  (via drill 0.3)
  Top 0.203: v43.16,56.9 43.16,56.82 42.61,56.74 IC13.79 | v29.83,62.61 28.56,62.61 v28.56,62.85 | v14.59,65.94 14.35,66.18 14.35,67.29 13.32,68.33 DSP1.26
  Route2 0.203: v43.16,56.9 42.13,56.9 40.38,58.64 33.8,58.64 v29.83,62.61 | v21.18,63.48 17.05,63.48 v14.59,65.94
  Route3 0.203: v28.56,62.85 28.32,62.61 24.91,62.61 23.64,63.88 21.57,63.88 v21.18,63.48
GPIOC12  (via drill 0.3)
  Top 0.203: v40.7,57.37 40.7,57.29 41.5,57.21 IC13.80
  Route2 0.203: v40.7,57.37 34.51,57.37 31.65,60.23 v30.15,60.23 | v23.32,62.85 22.92,62.85 22.68,62.61 13.95,62.61 13.32,63.24 DSP1.22
  Route3 0.203: v30.15,60.23 29.51,59.59 27.37,59.59 24.11,62.85 v23.32,62.85
GPIOC13  (via drill 0.3)
  Top 0.203: R10.2 101.98,89.76 103.25,89.76 C15.1 R115.1 103.17,84.99 102.38,84.2 102.38,83.33 v94.84,75.79 | v37.84,67.37 37.29,67.93 37.29,68.96 IC13.7
  Top 0.406: v59.28,71.66 60.15,72.53 v63.88,72.53
  Route2 0.203: v41.58,71.1 v37.84,67.37 | v44.04,71.02 45.47,71.02 46.58,72.14 50.78,72.14 51.26,71.66 v59.28,71.66 | v63.88,72.53 72.06,72.53 75.31,75.79 v94.84,75.79
  Route3 0.203: v41.58,71.1 42.53,71.1 42.61,71.18 43.88,71.18 v44.04,71.02
GPIOC14  (via drill 0.3)
  Top 0.203: 113.41,89.76 R18.1 113.33,89.68 113.33,89.52 | 114.68,89.76 C92.1 | v36.65,71.26 36.73,71.18 36.73,69.04 IC13.8 | v39.91,72.14 40.15,72.37 40.15,73.96 v40.62,74.44 | v42.85,75.23 44.75,77.14 44.75,77.77 46.34,79.36 v46.5,79.36
  Top 0.406: 114.68,89.76 113.41,89.76 | v56.1,88.96 v50.62,83.49 | 113.33,89.52 v111.9,89.52
  Route2 0.203: v39.91,72.14 v38.56,70.79 | v40.62,74.44 41.42,75.23 v42.85,75.23 | v50.62,83.49 v46.5,79.36 | v56.1,88.96 66.42,88.96 72.14,94.68 106.74,94.68 v111.9,89.52
  Route3 0.305: v36.65,71.26 38.08,71.26 v38.56,70.79
GPIOC15  (via drill 0.3)
  Top 0.203: 115.95,89.76 R19.1 115.87,89.68 115.87,89.44 v115,88.57 | 117.22,89.76 C91.1 | v36.02,70.63 36.26,70.39 36.26,69.04 IC13.9 | v43.96,75.23 45.15,76.42 45.15,77.22 v46.1,78.17 | v96.42,87.69 96.42,87.61
  Top 0.406: 117.22,89.76 115.95,89.76 | v60.86,81.98 v58.88,79.99 | 96.42,87.61 v93.72,87.61
  Route2 0.203: v46.1,78.17 52.93,78.17 54.75,79.99 v58.88,79.99 | v60.86,81.98 62.45,81.98 69.28,88.8 89.44,88.8 90.63,87.61 v93.72,87.61 | v96.42,87.69 97.3,88.57 v115,88.57
  Route3 0.203: v36.02,70.63 36.42,70.63 37.45,69.59 38.32,69.59 v43.96,75.23
GPIOD2  (via drill 0.3)
  Top 0.203: v98.17,56.02 91.98,56.02 v91.98,55.62 | v48.4,54.83 44.51,58.72 42.05,58.72 IC13.83 | 130.48,64.91 R45.1
  Top 0.406: v128.33,62.77 130.48,64.91
  Route2 0.203: v128.33,62.77 121.43,62.77 112.06,53.4 100.79,53.4 v98.17,56.02 | v91.98,55.62 57.93,55.62 57.13,54.83 v48.4,54.83
GPIOD3  (via drill 0.3)
  Top 0.203: v40.07,59.28 41.97,59.28 IC13.84 | v30.78,63.72 30.54,63.96 v30.54,66.42
  Route2 0.203: v40.07,59.28 35.23,59.28 v30.78,63.72 | v27.53,68.56 27.53,68.88 27.76,69.12 27.76,69.75 26.89,70.63 23.72,70.63 13.32,81.03 DSP1.36
  Route3 0.203: v30.54,66.42 29.99,66.42 29.11,67.29 29.11,68.17 28.72,68.56 v27.53,68.56
GPIOD13  (via drill 0.3)
  Top 0.203: v37.21,44.83 32.37,49.67 32.37,52.45 32.69,52.77 32.77,53.01 IC13.60
  Top 0.406: v129.36,40.31 R47.1 | v93.65,44.83 v98.17,40.31
  Route2 0.203: v98.17,40.31 v129.36,40.31 | v37.21,44.83 v93.65,44.83
GPIOE0  (via drill 0.3)
  Top 0.203: 118.49,89.76 R20.1 118.41,89.68 118.41,89.44 v116.9,87.93 | 119.76,89.76 C90.1 | v45.86,65.78 45.86,65.63 43.88,65.63 43.8,65.71 42.45,65.71 IC13.97 | v55.94,68.33 56.97,68.33 59.04,66.26 v59.04,65.86
  Top 0.406: 119.76,89.76 118.49,89.76
  Route2 0.203: v45.86,65.78 47.37,65.78 49.91,68.33 v55.94,68.33 | v59.04,65.86 64.99,65.86 70.15,71.02 91.19,71.02 92.38,72.21 96.66,72.21 102.93,78.48 104.6,78.48 114.05,87.93 v116.9,87.93
GPIOE1  (via drill 0.3)
  Top 0.203: v41.26,77.29 42.21,76.34 v42.21,71.74 | v43.16,66.74 42.69,66.26 42.05,66.26 IC13.98 | 31.73,88.01 R43.1
  Top 0.406: 31.73,88.01 32.77,86.98 v32.77,85.55
  Route2 0.203: v32.77,85.55 33.4,84.91 33.4,83.41 39.51,77.29 v41.26,77.29 | v42.21,71.74 42.21,67.69 v43.16,66.74
GPIOE2  (via drill 0.3)
  Top 0.203: 119.28,64.28 119.4,64.16 v119.36,64.12 | 120.32,63.24 R40.1 | 119.28,66.26 Q3.3 | v40.94,68.33 40.31,68.96 IC13.1 | v65.47,61.34 v57.21,69.59 | v105.95,64.75 v104.6,63.4
  Top 0.406: 119.4,64.16 120.32,63.24 | 119.28,66.26 119.28,64.28
  Route2 0.203: v41.58,68.33 v40.94,68.33 | v43.96,67.21 45.62,67.21 46.66,68.25 46.66,68.88 47.37,69.59 v57.21,69.59 | v65.47,61.34 66.1,60.7 101.9,60.7 v104.6,63.4 | v105.95,64.75 114.68,64.75 115.31,64.12 v119.36,64.12
  Route3 0.203: v41.58,68.33 42.85,68.33 v43.96,67.21
GPIOE3  (via drill 0.3)
  Top 0.203: v115.31,63.48 v116.58,64.75 | v99.2,55.94 98.65,55.39 v92.93,55.39 | v43.16,52.45 39.43,56.18 39.43,60.23 39.91,60.7 39.91,66.1 39.43,66.58 39.43,68.01 39.75,68.33 IC13.2 | 130,77.14 R50.1
  Top 0.406: v125.47,72.61 130,77.14
  Route2 0.203: v125.47,72.61 124.44,72.61 v116.58,64.75 | v115.31,63.48 107.77,55.94 v99.2,55.94 | v92.93,55.39 91.5,53.96 58.8,53.96 57.13,52.29 43.32,52.29 v43.16,52.45
GPIOE4  (via drill 0.3)
  Top 0.203: v54.83,71.02 v66.9,58.96 | v45.94,74.36 v49.27,71.02 | v41.58,74.36 40.54,73.33 40.54,70.94 39.27,69.67 39.27,69.04 IC13.3 | 130.48,52.61 R49.1
  Top 0.406: v129.6,51.74 130.48,52.61 | v98.17,51.74 96.34,53.56 v95.79,53.56
  Route2 0.203: v98.17,51.74 v129.6,51.74 | v95.79,53.56 92.3,57.05 68.8,57.05 v66.9,58.96 | v49.27,71.02 v54.83,71.02 | v41.58,74.36 v45.94,74.36
GPIOE6  (via drill 0.3)
  Top 0.203: v103.33,63.17 v107.22,67.06 | v55.47,72.29 v66.42,61.34 | v41.02,69.44 v43.72,72.29 | v38.8,67.37 38.24,67.93 38.24,68.96 IC13.5 | 120.55,69.75 R48.1
  Top 0.406: v119.44,70.86 120.55,69.75
  Route2 0.203: v119.44,70.86 111.03,70.86 v107.22,67.06 | v103.33,63.17 100.95,63.17 99.12,61.34 v66.42,61.34 | v55.47,72.29 52.29,72.29 52.05,72.06 51.42,72.06 50.94,72.53 43.96,72.53 v43.72,72.29 | v38.8,67.37 v41.02,69.44
IMESS  (via drill 0.3)
  Top 0.203: v110.31,60.47 110.47,60.47 111.27,59.67 R88.1 | v100.95,68.01 98.41,70.55 v97.69,70.55 | v95.15,73.09 v96.66,71.58 | v74.83,73.09 63.56,84.36 63.56,85.47 IC4.1 63.48,85.55 | v22.13,76.82 19.67,74.36 19.67,62.21 23.64,62.21 23.95,62.53 23.95,62.77 26.49,62.77 IC13.35 | v50.78,87.06 v45.07,92.77
  Top 0.406: v63.24,87.06 63.48,86.82 63.48,85.55
  Route2 0.203: v110.31,60.47 108.49,60.47 v100.95,68.01 | v96.66,71.58 v97.69,70.55 | v74.83,73.09 v95.15,73.09 | v22.13,76.82 38.08,92.77 v45.07,92.77 | v63.24,87.06 v50.78,87.06
LDCLIGHT  (via drill 0.3)
  Top 0.203: 17.29,88.01 R25.1
  Top 0.406: v14.03,84.76 17.29,88.01
  Route2 0.203: v14.03,84.76 11.89,84.76 10.78,83.64 DSP1.37
N$1
  Top 0.203: 120.63,71.42 R48.2 | 122.54,71.42 R56.1 122.62,71.5 | 124.44,71.5 Q10.1
  Top 0.406: 122.54,71.42 120.63,71.42 | 122.62,71.5 124.44,71.5
N$2  (via drill 0.3)
  Top 0.203: R14.2 140.08,93.33 | 140.08,93.33 C102.1 | v131.03,78.01 131.03,74.91 126.75,70.63 Q10.3 | v140,93.33 140.08,93.33
  Route2 0.203: v131.03,78.01 131.03,79.2 131.67,79.83 131.67,82.14 140,90.47 v140,93.33
N$3
  Top 0.406: R24.1 R91.2
N$4
  Top 0.203: D6.A 123.01,57.37 123.01,58.48 121.74,59.75 R35.2 121.74,59.91 122.62,60.78 122.62,62.77 D7.C 122.7,62.85 | 121.51,65.47 121.51,65.39 Q3.1 | 124.28,65.47 R33.2
  Top 0.406: 121.51,65.47 122.7,65.47 | 122.7,65.47 124.28,65.47 | 122.7,65.47 122.7,62.85
N$6
  Top 0.203: 28,85.31 Q2.1 | 28,87.93 R41.1
  Top 0.406: R43.2 R41.1 | 28,87.93 28,85.31
N$8
  Top 0.203: 23.24,83.33 R32.2 23.24,83.17 | 20.54,83.33 Q1.1 | 27.05,83.17 Q2.3
  Top 0.406: 20.54,83.33 23.24,83.33 | 23.24,83.17 27.05,83.17
N$9
  Top 0.203: R102.1 48.64,61.26 50.62,61.26 50.62,61.74 LED1.3
N$10
  Top 0.203: 18.95,88.01 R25.2 | 18.4,84.2 Q1.3
  Top 0.406: 18.95,88.01 18.4,87.45 18.4,84.2
N$12
  Top 0.406: JP8.1 R4.1
N$13
  Top 0.203: 172.78,73.64 C64.1 | 170.4,74.28 IC12.3
  Top 0.305: 172.78,73.64 171.59,74.28 170.4,74.28
N$15
  Top 0.203: 172.78,71.82 C64.2 | 170.4,71.82 IC12.1
  Top 0.305: 170.4,71.82 172.78,71.82
N$16
  Top 0.203: 24.43,91.98 R113.1 | 26.97,91.98 ST6.2 26.97,92.06 | 28.48,96.9 MOD1.P$4
  Top 0.406: 26.97,91.98 24.43,91.98 | 28.48,96.9 28.4,96.42 27.61,92.69 26.97,92.06
N$17
  Top 0.203: R114.1 32.29,91.58 33.08,90.79 42.21,90.79 42.21,91.5 LED2.3
N$18
  Top 0.203: 34.27,91.66 R112.1 | 39.19,93.25 LED2.2
  Top 0.406: 34.27,91.66 35.86,93.25 39.19,93.25
N$19
  Top 0.406: R70.2 R75.2
N$20
  Top 0.203: 40.07,100.08 R110.1 | 42.21,93.33 LED2.4
  Top 0.406: 40.07,100.08 42.21,97.93 42.21,93.33
N$21
  Top 0.406: R71.2 R79.2
N$22  (via drill 0.3)